# EAGLE design ADS1293+AFE4400testpcb (EAGLE 8.6.0)
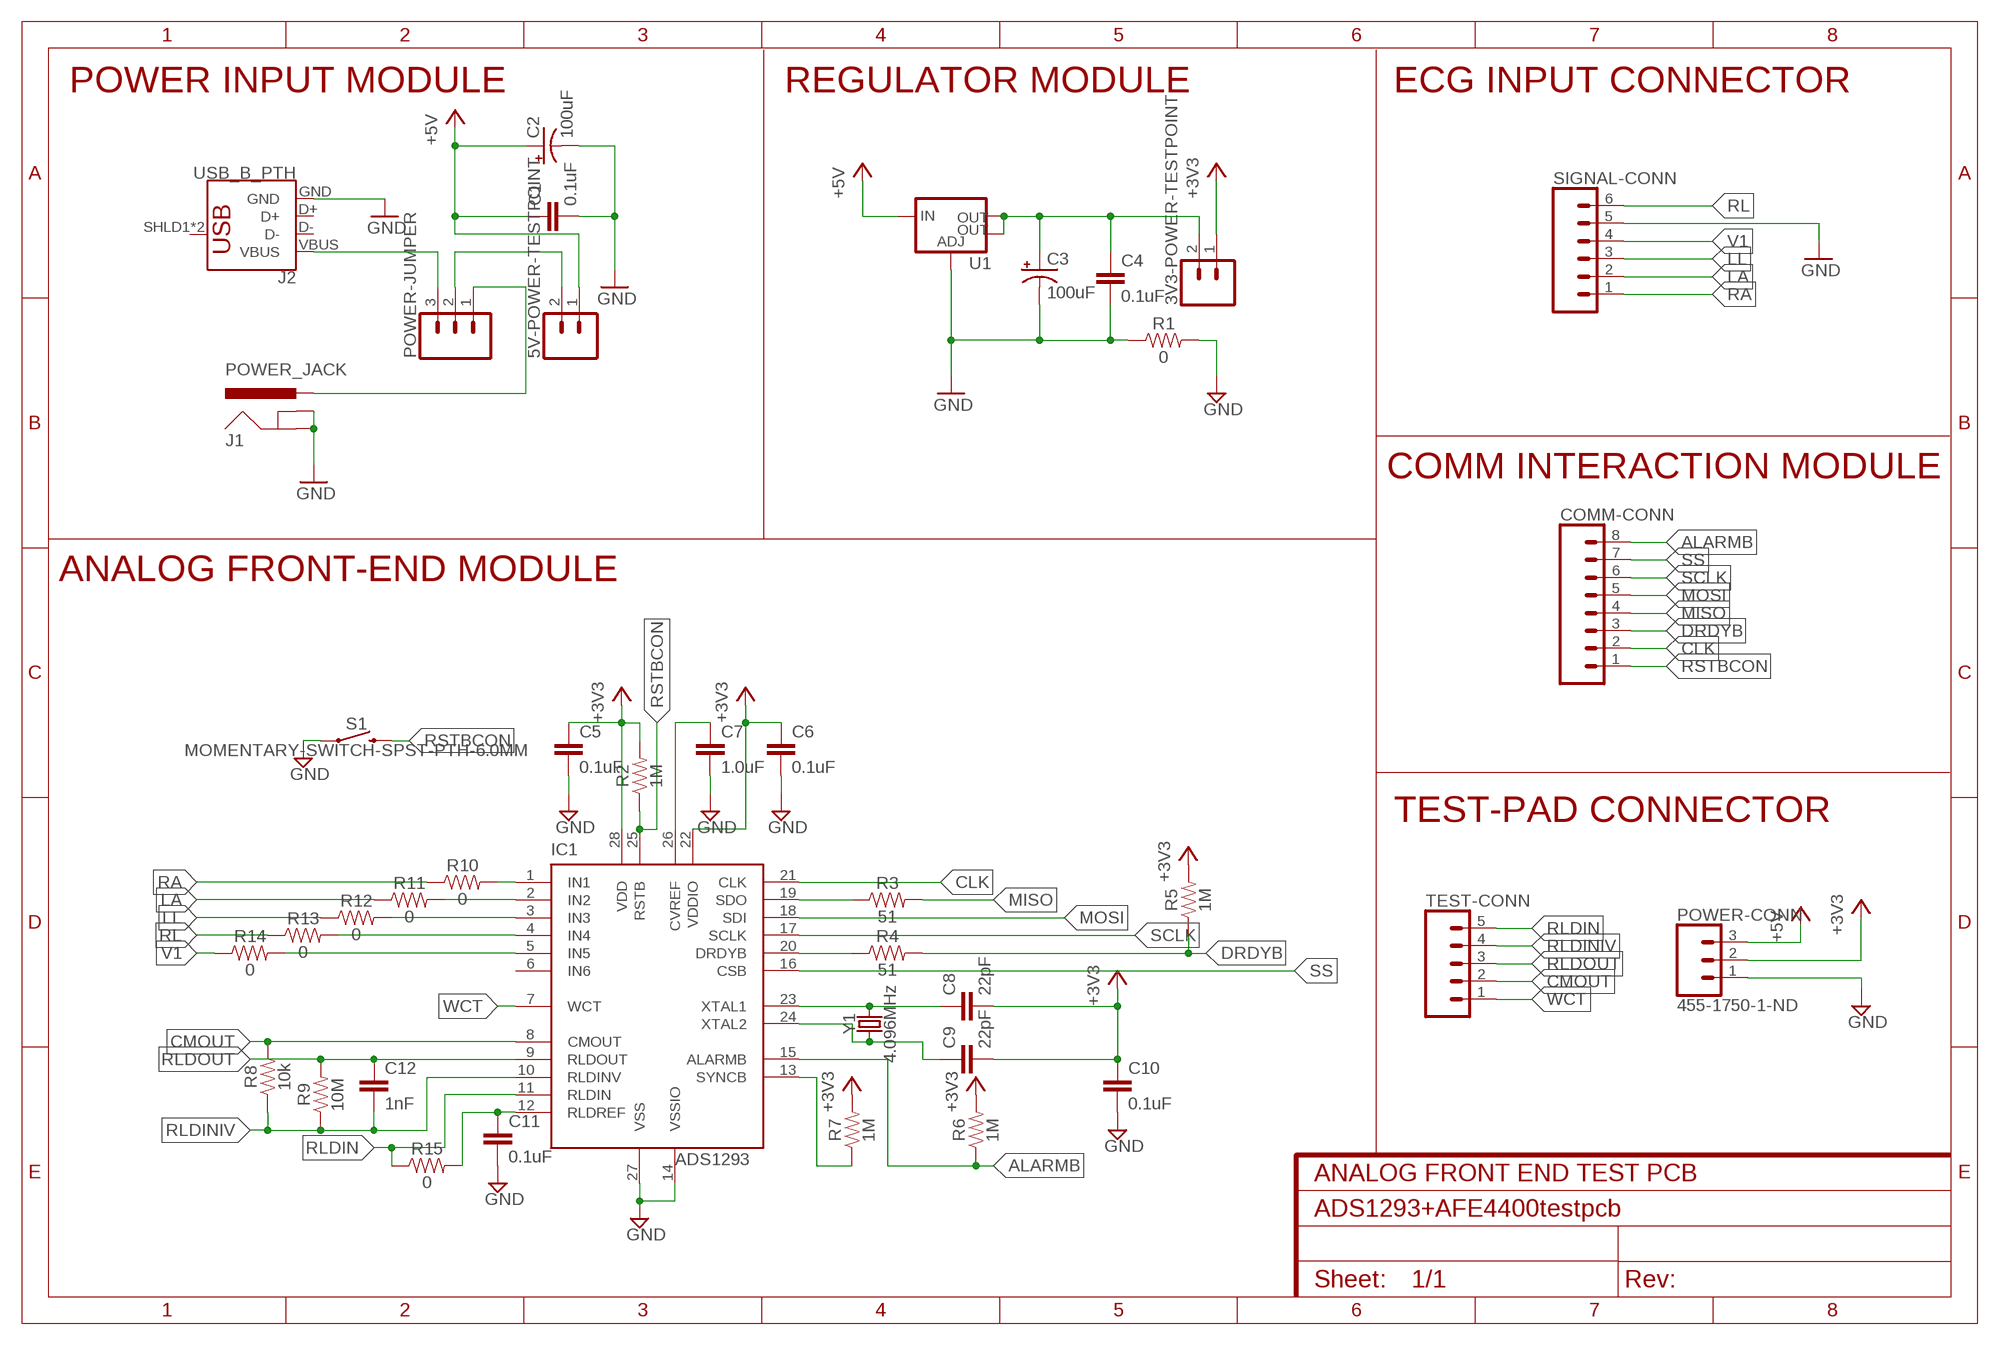
[diagram p0: schematic, sheet 1, part 1 of 2]
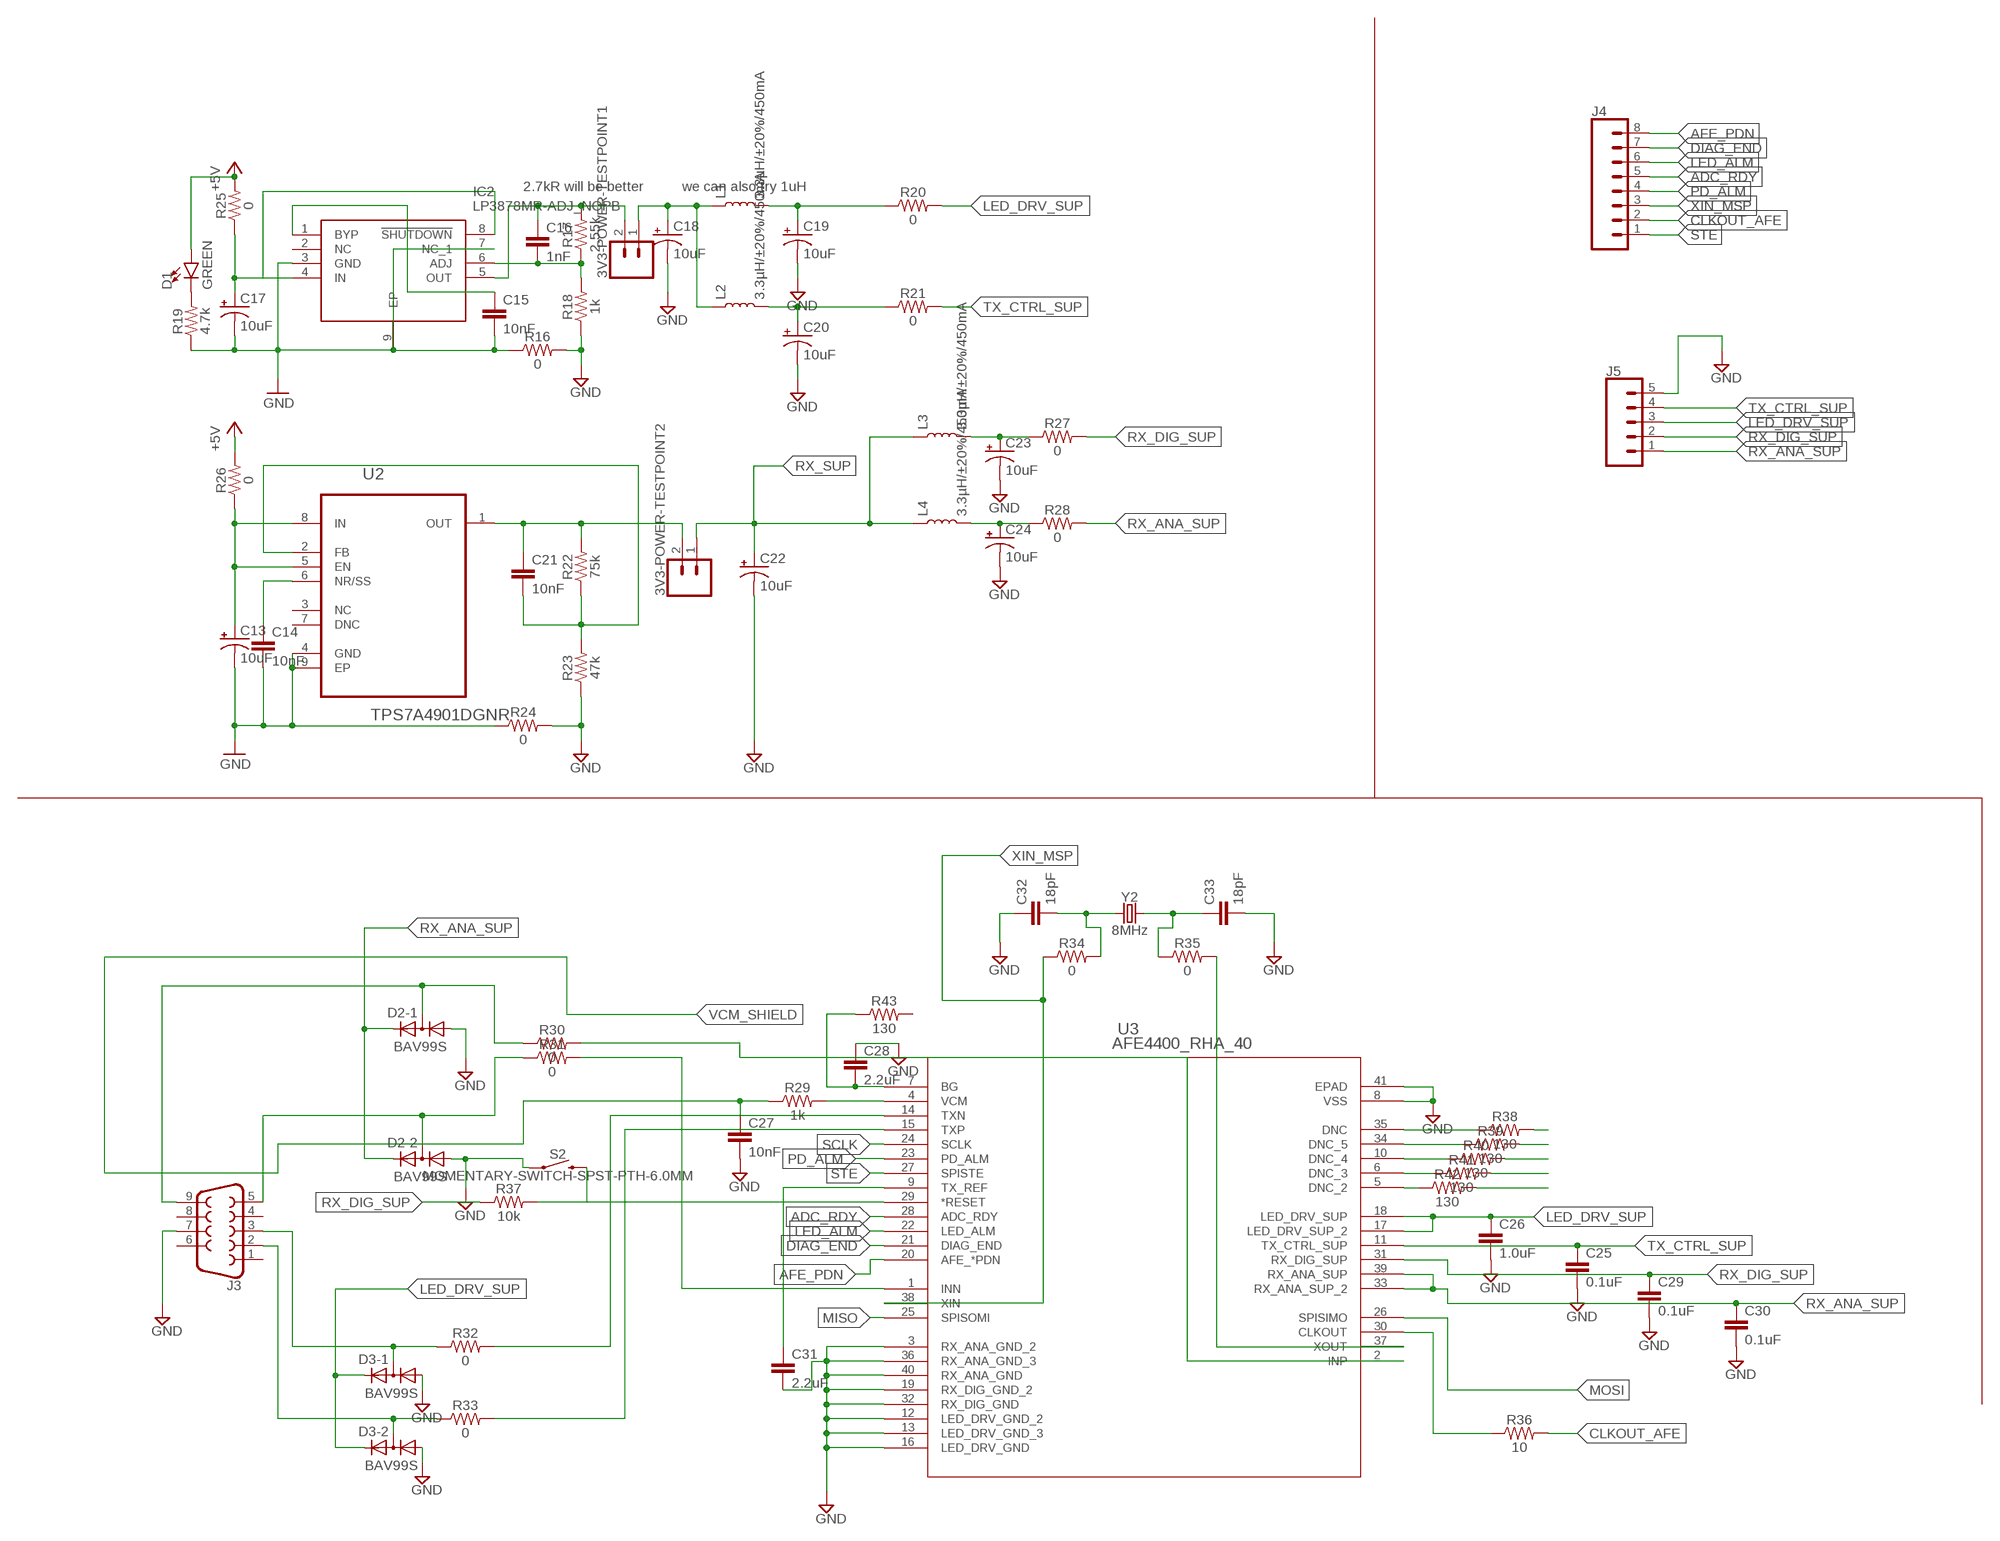
[diagram p1: schematic, sheet 1, part 2 of 2]
ADS1293TESTBOARD (FRAME-A4L): CNAME: ANALOG FRONT END TEST PCB; DESIGNER: JINGJIE LI

## Parts
3V3-POWER-TESTPOINT  CONN_02  [1X02]
3V3-POWER-TESTPOINT1  CONN_02  [1X02]
3V3-POWER-TESTPOINT2  CONN_02  [1X02]
5V-POWER-TESTPOINT  CONN_02  [1X02]
C1  0.1uF  0.1UF-0603-25V-(+80/-20%)  [0603]
C2  100uF  100UF-POLAR-RADIAL-2.5MM-25V-20%  [CPOL-RADIAL-2.5MM-6.5MM]
C3  100uF  100UF-POLAR-RADIAL-2.5MM-25V-20%  [CPOL-RADIAL-2.5MM-6.5MM]
C4  0.1uF  0.1UF-0603-25V-(+80/-20%)  [0603]
C5  0.1uF  0.1UF-0603-25V-(+80/-20%)  [0603]
C6  0.1uF  0.1UF-0603-25V-(+80/-20%)  [0603]
C7  1.0uF  1.0UF-0805-25V-10%  [0805]
C8  22pF  22PF-0603-50V-5%  [0603]
C9  22pF  22PF-0603-50V-5%  [0603]
C10  0.1uF  0.1UF-0603-25V-(+80/-20%)  [0603]
C11  0.1uF  0.1UF-0603-25V-(+80/-20%)  [0603]
C12  1nF  1.0NF/1000PF-0603-50V-10%  [0603]
C13  10uF  10UF-TANT  [EIA3216]
C14  10nF  10NF-0603-50V-10%  [0603]
C15  10nF  10NF-0603-50V-10%  [0603]
C16  1nF  1.0NF/1000PF-0603-50V-10%  [0603]
C17  10uF  10UF-TANT  [EIA3216]
C18  10uF  10UF-TANT  [EIA3216]
C19  10uF  10UF-TANT  [EIA3216]
C20  10uF  10UF-TANT  [EIA3216]
C21  10nF  10NF-0603-50V-10%  [0603]
C22  10uF  10UF-TANT  [EIA3216]
C23  10uF  10UF-TANT  [EIA3216]
C24  10uF  10UF-TANT  [EIA3216]
C25  0.1uF  0.1UF-0603-25V-5%  [0603]
C26  1.0uF  1.0UF-0805-25V-10%  [0805]
C27  10nF  10NF-0603-50V-10%  [0603]
C28  2.2uF  2.2UF-0805-25V-(+80/-20%)  [0805]
C29  0.1uF  0.1UF-0603-25V-5%  [0603]
C30  0.1uF  0.1UF-0603-25V-5%  [0603]
C31  2.2uF  2.2UF-0805-25V-(+80/-20%)  [0805]
C32  18pF  18PF-0603-50V-5%  [0603]
C33  18pF  18PF-0603-50V-5%  [0603]
COMM-CONN  CONN_08"  [1X08]
D1  GREEN  LED-GREEN1206  [LED-1206]
D2  BAV99S  [SOT363]
D3  BAV99S  [SOT363]
IC1  ADS1293  [QFN28-5X5]
IC2  LP3878MR-ADJ_NOPB  [SOIC127P602X168-9N]
J1  POWER_JACK  [POWER_JACK_PTH]
J2  USB_B_PTH  [USB-B-PTH]
J3  DB9FEMALE  [DB9]
J4  CONN_08"  [1X08]
J5  CONN_05  [1X05]
L1  3.3µH/±20%/450mA  INDUCTOR-0805-3.3UH  [0805]
L2  3.3µH/±20%/450mA  INDUCTOR-0805-3.3UH  [0805]
L3  3.3µH/±20%/450mA  INDUCTOR-0805-3.3UH  [0805]
L4  3.3µH/±20%/450mA  INDUCTOR-0805-3.3UH  [0805]
POWER-CONN  455-1750-1-ND  CONN_03  [1X03]
POWER-JUMPER  CONN_03  [1X03]
R1  0  0OHM-0603-1/10W-5%  [0603]
R2  1M  1MOHM-0603-1/4W-5%  [0603]
R3  51  22OHM-0603-1/10W-1%  [0603]
R4  51  22OHM-0603-1/10W-1%  [0603]
R5  1M  1MOHM-0603-1/4W-5%  [0603]
R6  1M  1MOHM-0603-1/4W-5%  [0603]
R7  1M  1MOHM-0603-1/4W-5%  [0603]
R8  10k  10KOHM-0603-1/10W-1%  [0603]
R9  10M  10MOHM-0603-1/10W-5%  [0603]
R10  0  0OHM-0603-1/10W-5%  [0603]
R11  0  0OHM-0603-1/10W-5%  [0603]
R12  0  0OHM-0603-1/10W-5%  [0603]
R13  0  0OHM-0603-1/10W-5%  [0603]
R14  0  0OHM-0603-1/10W-5%  [0603]
R15  0  0OHM-0603-1/10W-5%  [0603]
R16  0  0OHM-0603-1/10W-5%  [0603]
R17  2.55k  2.55KOHM-0603-1/10W-1%  [0603]
R18  1k  1KOHM-0603-1/10W-1%  [0603]
R19  4.7k  4.7KOHM-0603-1/10W-1%  [0603]
R20  0  0OHM-0603-1/10W-5%  [0603]
R21  0  0OHM-0603-1/10W-5%  [0603]
R22  75k  75KOHM-0603-1/10W-1%  [0603]
R23  47k  47KOHM-0603-1/10W-1%  [0603]
R24  0  0OHM-0603-1/10W-5%  [0603]
R25  0  0OHM-0603-1/10W-5%  [0603]
R26  0  0OHM-0603-1/10W-5%  [0603]
R27  0  0OHM-0603-1/10W-5%  [0603]
R28  0  0OHM-0603-1/10W-5%  [0603]
R29  1k  1KOHM-0603-1/10W-1%  [0603]
R30  0  0OHM-0603-1/10W-5%  [0603]
R31  0  0OHM-0603-1/10W-5%  [0603]
R32  0  0OHM-0603-1/10W-5%  [0603]
R33  0  0OHM-0603-1/10W-5%  [0603]
R34  0  0OHM-0603-1/10W-5%  [0603]
R35  0  0OHM-0603-1/10W-5%  [0603]
R36  10  10OHM-0603-1/10W-1%  [0603]
R37  10k  10KOHM-0603-1/10W-1%  [0603]
R38  130  330OHM-0603-1/10W-1%  [0603]
R39  130  330OHM-0603-1/10W-1%  [0603]
R40  130  330OHM-0603-1/10W-1%  [0603]
R41  130  330OHM-0603-1/10W-1%  [0603]
R42  130  330OHM-0603-1/10W-1%  [0603]
R43  130  330OHM-0603-1/10W-1%  [0603]
S1  MOMENTARY-SWITCH-SPST-PTH-6.0MM  [TACTILE_SWITCH_PTH_6.0MM]
S2  MOMENTARY-SWITCH-SPST-PTH-6.0MM  [TACTILE_SWITCH_PTH_6.0MM]
SIGNAL-CONN  CONN_06POLAR  [MOLEX-1X6]
TEST-CONN  CONN_05  [1X05]
U1  V_REG_LM1117SOT223  [SOT223]
U2  TPS7A4901DGNR  [SOP65P490X110-9N]
U3  AFE4400_RHA_40  [RHA40_4P15X4P15]
Y1  4.096MHz  CRYSTALPTH-HC49US  [HC49US]
Y2  8MHz  CRYSTAL-8MHZSMD-5X3.2  [CRYSTAL-SMD-5X3.2-4PAD]

## Nets
+3V3: 3V3-POWER-TESTPOINT.1 C5.1 C6.1 C8.2 C9.2 C10.1 IC1.22(VDDIO) IC1.28(VDD) POWER-CONN.2 R2.2 R5.2 R6.2 R7.2
+5V: 5V-POWER-TESTPOINT.1 C1.1 C2.1(+) D1.A POWER-CONN.3 R25.2 R26.2 U1.3(IN)
ADC_RDY: J4.5 U3.28(ADC_RDY)
AFE_PDN: J4.8 U3.20(AFE_*PDN)
ALARMB: COMM-CONN.8 IC1.15(ALARMB) R6.1
CLK: COMM-CONN.2 IC1.21(CLK)
CLKOUT_AFE: J4.2 R36.2
CMOUT: IC1.8(CMOUT) R8.2 TEST-CONN.2
DIAG_END: J4.7 U3.21(DIAG_END)
DRDYB: COMM-CONN.3 R4.2 R5.1
GND: C1.2 C2.2(-) C3.2(-) C4.2 C5.2 C6.2 C7.2 C10.2 C11.2 C13.C(-) C14.2 C15.2 C17.C(-) C18.C(-) C19.C(-) C20.C(-) C22.C(-) C23.C(-) C24.C(-) C25.2 C26.2 C27.2 C28.1 C29.2 C30.2 C31.2 C32.1 C33.2 D2.1(-1:A1) D2.4(-2:A1) D3.1(-1:A1) D3.4(-2:A1) IC1.14(VSSIO) IC1.27(VSS) IC2.3(GND) IC2.7(NC_1) IC2.9(EP) J1.GND J1.GNDBREAK J2.GND J3.7 J5.5 POWER-CONN.1 R1.1 R1.2 R16.1 R16.2 R18.1 R19.1 R23.1 R24.1 R24.2 S1.1 S2.1 SIGNAL-CONN.5 U1.1(ADJ) U2.4(GND) U2.9(EP) U3.3(RX_ANA_GND_2) U3.8(VSS) U3.12(LED_DRV_GND_2) U3.13(LED_DRV_GND_3) U3.16(LED_DRV_GND) U3.19(RX_DIG_GND_2) U3.32(RX_DIG_GND) U3.36(RX_ANA_GND_3) U3.40(RX_ANA_GND) U3.41(EPAD)
LA: R11.1 SIGNAL-CONN.2
LED_ALM: J4.6 U3.22(LED_ALM)
LED_DRV_SUP: C26.1 D3.2(-1:K2) D3.5(-2:K2) J5.3 R20.2 U3.17(LED_DRV_SUP_2) U3.18(LED_DRV_SUP)
LL: R12.1 SIGNAL-CONN.3
MISO: COMM-CONN.4 R3.2 U3.25(SPISOMI)
MOSI: COMM-CONN.5 IC1.18(SDI) U3.26(SPISIMO)
N$1: C7.1 IC1.26(CVREF)
N$2: J2.VBUS POWER-JUMPER.3
N$3: J1.PWR POWER-JUMPER.1
N$4: D1.C R19.2
N$5: C8.1 IC1.23(XTAL1) Y1.2
N$6: C9.1 IC1.24(XTAL2) Y1.1
N$7: IC1.19(SDO) R3.1
N$8: IC1.20(DRDYB) R4.1
N$9: IC1.13(SYNCB) R7.1
N$10: C11.1 IC1.12(RLDREF) R15.2
N$11: IC1.1(IN1) R10.2
N$12: IC1.2(IN2) R11.2
N$13: IC1.3(IN3) R12.2
N$14: IC1.4(IN4) R13.2
N$15: IC1.5(IN5) R14.2
N$16: 5V-POWER-TESTPOINT.2 POWER-JUMPER.2
N$17: 3V3-POWER-TESTPOINT.2 C3.1(+) C4.1 U1.2(OUT) U1.4(OUT)
N$18: 3V3-POWER-TESTPOINT1.1 C18.A(+) L1.1 L2.1
N$19: C16.2 IC2.6(ADJ) R17.1 R18.2
N$20: C15.1 IC2.1(BYP)
N$21: 3V3-POWER-TESTPOINT1.2 C16.1 IC2.5(OUT) R17.2
N$22: C14.1 U2.6(NR/SS)
N$23: C19.A(+) L1.2 R20.1
N$24: C20.A(+) L2.2 R21.1
N$25: C13.A(+) R26.1 U2.5(EN) U2.8(IN)
N$26: 3V3-POWER-TESTPOINT2.2 C21.1 R22.2 U2.1(OUT)
N$27: C21.2 R22.1 R23.2 U2.2(FB)
N$28: C23.A(+) L3.2 R27.1
N$29: C17.A(+) IC2.4(IN) IC2.8(!SHUTDOWN) R25.1
N$30: C24.A(+) L4.2 R28.1
N$31: C28.2 R43.1 U3.7(BG)
N$32: C31.1 U3.9(TX_REF)
N$33: R32.2 U3.14(TXN)
N$34: R29.2 U3.4(VCM)
N$36: R31.2 U3.1(INN)
N$37: R30.2 U3.2(INP)
N$38: D2.3(-2:K1A2) J3.5 R31.1
N$39: D2.6(-1:K1A2) J3.9 R30.1
N$40: R33.2 U3.15(TXP)
N$41: D3.6(-1:K1A2) J3.3 R32.1
N$42: D3.3(-2:K1A2) J3.2 R33.1
N$43: C32.2 R34.2 Y2.1
N$44: C33.1 R35.1 Y2.3
N$45: R36.1 U3.30(CLKOUT)
N$46: R37.2 S2.3 U3.29(*RESET)
N$48: R35.2 U3.37(XOUT)
N$49: R38.1 U3.35(DNC)
N$50: R42.1 U3.5(DNC_2)
N$52: R41.1 U3.6(DNC_3)
N$53: R40.1 U3.10(DNC_4)
N$54: R39.1 U3.34(DNC_5)
N$55: R38.2
N$56: R39.2
N$57: R40.2
N$58: R41.2
N$59: R42.2
PD_ALM: J4.4 U3.23(PD_ALM)
RA: R10.1 SIGNAL-CONN.1
RL: R13.1 SIGNAL-CONN.6
RLDIN: IC1.11(RLDIN) R15.1 TEST-CONN.5
RLDINIV: C12.2 IC1.10(RLDINV) R8.1 R9.1 TEST-CONN.4
RLDOUT: C12.1 IC1.9(RLDOUT) R9.2 TEST-CONN.3
RSTBCON: COMM-CONN.1 IC1.25(RSTB) R2.1 S1.3
RX_ANA_SUP: C30.1 D2.2(-1:K2) D2.5(-2:K2) J5.1 R28.2 U3.33(RX_ANA_SUP_2) U3.39(RX_ANA_SUP)
RX_DIG_SUP: C29.1 J5.2 R27.2 R37.1 U3.31(RX_DIG_SUP)
RX_SUP: 3V3-POWER-TESTPOINT2.1 C22.A(+) L3.1 L4.1
SCLK: COMM-CONN.6 IC1.17(SCLK) U3.24(SCLK)
SS: COMM-CONN.7 IC1.16(CSB)
STE: J4.1 U3.27(SPISTE)
TX_CTRL_SUP: C25.1 J5.4 R21.2 U3.11(TX_CTRL_SUP)
V1: R14.1 SIGNAL-CONN.4
VCM_SHIELD: C27.1 R29.1
WCT: IC1.7(WCT) TEST-CONN.1
XIN_MSP: J4.3 R34.1 U3.38(XIN)
Unconnected: IC1.6(IN6) IC2.2(NC) J2.D+ J2.D- J2.SHLD1(SHIELD) J2.SHLD2(SHIELD) J3.1 J3.4 J3.6 J3.8 R43.2 U2.3(NC) U2.7(DNC)

## Notes on the sheet
- 2.7kR will be better | we can also try 1uH
- POWER INPUT MODULE | REGULATOR MODULE | ECG INPUT CONNECTOR
- COMM INTERACTION MODULE
- ANALOG FRONT-END MODULE
- TEST-PAD CONNECTOR

## Library data of the parts
3V3-POWER-TESTPOINT 3V3-POWER-TESTPOINT1 3V3-POWER-TESTPOINT2 5V-POWER-TESTPOINT = SparkFun-Connectors:CONN_02: Multi connection point. Often used as Generic Header-pin footprint for 0.1 inch spaced/style header connections On any of the 0.1 inch spaced packages, you can populate with these: Break Away Headers - Straight <https://www.sparkfun.com/products/116> (PRT-00116) Break Away Male Headers - Right Angle <https://www.sparkfun.com/products/553> (PRT-00553) Female Headers <https://www.sparkfun.com/products/115> (PRT-00115) Break Away Headers - Machine Pin <https://www.sparkfun.com/products/117> (PRT-00117) Break Away Female Headers - Swiss Machine Pin <https://www.sparkfun.com/products/743> (PRT-00743) For SCREWTERMINALS and SPRING TERMINALS visit here: Screw Terimnals on SparkFun.com <https://www.sparkfun.com/search/results?term=Screw+Terminals> (5mm/3.5mm/2.54mm spacing) This device is also useful as a general connection point to wire up your design to another part of your project. Our various solder wires solder well into these plated through hole pads. Hook-Up Wire - Assortment (Stranded, 22 AWG) <https://www.sparkfun.com/products/11375> (PRT-11375) Hook-Up Wire - Assortment (Solid Core, 22 AWG) <https://www.sparkfun.com/products/11367> (PRT-11367) View the entire wire category on our website here <https://www.sparkfun.com/categories/141> Special notes: Molex polarized connector foot print use with: PRT-08233 with associated crimp pins and housings. 2.54_SCREWTERM for use with PRT-10571. 3.5mm Screw Terminal footprints for PRT-08084 5mm Screw Terminal footprints for use with PRT-08432
C1 C4-C6 C10 C11 = SparkFun-Capacitors:0.1UF: 0.1µF ceramic capacitors A capacitor is a passive two-terminal electrical component used to store electrical energy temporarily in an electric field.; PROD_ID: CAP-00810
C2 C3 = SparkFun-Capacitors:100UF-POLAR: 100µF polarized capacitors A capacitor is a passive two-terminal electrical component used to store electrical energy temporarily in an electric field.; PROD_ID: CAP-08439
C7 C26 = SparkFun-Capacitors:1.0UF: 1µF ceramic capacitors A capacitor is a passive two-terminal electrical component used to store electrical energy temporarily in an electric field.; PROD_ID: CAP-08064
C8 C9 = SparkFun-Capacitors:22PF: 22pF ceramic capacitors A capacitor is a passive two-terminal electrical component used to store electrical energy temporarily in an electric field.; PROD_ID: CAP-07876
C12 C16 = SparkFun-Capacitors:1.0NF/1000PF: 1nF/1,000pF ceramic capacitors A capacitor is a passive two-terminal electrical component used to store electrical energy temporarily in an electric field.; PROD_ID: CAP-07886
C13 C17-C20 C22-C24 = SparkFun-Retired:10UF-TANT: 10uF Tantalum SMT CAP-00811- 16V 10% (EIA-3216); PROD_ID: CAP-00811
C14 C15 C21 C27 = SparkFun-Capacitors:10NF: 0.01uF/10nF/10,000pF ceramic capacitors A capacitor is a passive two-terminal electrical component used to store electrical energy temporarily in an electric field. CAP-09321; PROD_ID: CAP-00867
C25 C29 C30 = SparkFun-Capacitors:0.1UF: 0.1µF ceramic capacitors A capacitor is a passive two-terminal electrical component used to store electrical energy temporarily in an electric field.; PROD_ID: CAP-08604
C28 C31 = SparkFun-Capacitors:2.2UF: 2.2µF ceramic capacitors A capacitor is a passive two-terminal electrical component used to store electrical energy temporarily in an electric field.; PROD_ID: CAP-11624
C32 C33 = SparkFun-Capacitors:18PF: 18pF ceramic capacitors A capacitor is a passive two-terminal electrical component used to store electrical energy temporarily in an electric field.; PROD_ID: CAP-08267
COMM-CONN J4 = SparkFun-Connectors:CONN_08: Multi connection point. Often used as Generic Header-pin footprint for 0.1 inch spaced/style header connections On any of the 0.1 inch spaced packages, you can populate with these: Break Away Headers - Straight <https://www.sparkfun.com/products/116> (PRT-00116) Break Away Male Headers - Right Angle <https://www.sparkfun.com/products/553> (PRT-00553) Female Headers <https://www.sparkfun.com/products/115> (PRT-00115) Break Away Headers - Machine Pin <https://www.sparkfun.com/products/117> (PRT-00117) Break Away Female Headers - Swiss Machine Pin <https://www.sparkfun.com/products/743> (PRT-00743) Arduino Stackable Header - 8 Pin <https://www.sparkfun.com/products/9279> (PRT-09279) For SCREWTERMINALS and SPRING TERMINALS visit here: Screw Terimnals on SparkFun.com <https://www.sparkfun.com/search/results?term=Screw+Terminals> (5mm/3.5mm/2.54mm spacing) This device is also useful as a general connection point to wire up your design to another part of your project. Our various solder wires solder well into these plated through hole pads. Hook-Up Wire - Assortment (Stranded, 22 AWG) <https://www.sparkfun.com/products/11375> (PRT-11375) Hook-Up Wire - Assortment (Solid Core, 22 AWG) <https://www.sparkfun.com/products/11367> (PRT-11367) View the entire wire category on our website here <https://www.sparkfun.com/categories/141> Special notes: Molex polarized connector foot print use with SKU : PRT-08231 with associated crimp pins and housings. 1MM SMD Version SKU: PRT-10208 NOTES ON THE VARIANTS LOCK and LOCK_LONGPADS... This footprint was designed to help hold the alignment of a through-hole component (i.e. 6-pin header) while soldering it into place. You may notice that each hole has been shifted either up or down by 0.005 of an inch from it's more standard position (which is a perfectly straight line). This slight alteration caused the pins (the squares in the middle) to touch the edges of the holes. Because they are alternating, it causes a "brace" to hold the component in place. 0.005 has proven to be the perfect amount of "off-center" position when using our standard breakaway headers. Although looks a little odd when you look at the bare footprint, once you have a header in there, the alteration is very hard to notice. Also,if you push a header all the way into place, it is covered up entirely on the bottom side.; PROD_ID: CONN-08438
D1 = SparkFun-LED:LED-GREEN: Green SMD LED Used in manufacturing of various products at SparkFun Packages: 0603 - SMD 0603 package [Product Link] <http://www.futureelectronics.com/en/technologies/semiconductors/optoelectronics/leds/Pages/9894312-LTST-C190GKT.aspx?CrossPart=HSMG-C190&IM=0> LilyPad 1206 - SMD1206 LilyPad package [Product Link] <http://www.futureelectronics.com/en/Technologies/Product.aspx?ProductID=IN150NGHARVATEKCORPORATION2049943&IM=0> 1206 - SMD1206 package [Product Link] <http://www.futureelectronics.com/en/technologies/semiconductors/optoelectronics/leds/Pages/8315665-LTST-C150KGKT.aspx?IM=0> 1206 Bottom Mount -SMD 1206 Bottom Mount [Product Link] <http://www.digikey.com/product-detail/en/lite-on-inc/LTST-C230KGKT/160-1456-1-ND/386854> SparkFun Products: Pro Mini 328 -5V <https://www.sparkfun.com/products/821> RedBoard <https://www.sparkfun.com/products/12757> MP3 Trigger <https://www.sparkfun.com/products/13720> Makey Makey <https://www.sparkfun.com/products/11076>; PROD_ID: DIO-00862
D2 D3 = nxp_60:BAV99S: High-speed switching diode High-speed switching diodes, encapsulated in small Surface-Mounted Device (SMD) plastic packages. AAL Eindhoven MK
IC1 = texas-ads1293:ADS1293: The ADS1293 incorporates all features commonly required in portable, low-power medical, sports, and fitness electrocardiogram (ECG) applications. With high levels of integration and exceptional performance, the ADS1293 enables the creation of scalable medical instrumentation systems at significantly reduced size, power, and overall cost. The library has been designed by Richard Magdycz <https://www.facebook.com/groups/eaglecadsoftUK>
IC2 = LP3878MR-ADJ_NOPB:LP3878MR-ADJ_NOPB: Micropower 800mA Low Noise 'Ceramic Stable' Adjustable Voltage Regulator for 1V to 5V App. Source: Datasheet <http://www.ti.com/lit/ds/symlink/lp3878-adj.pdf>; ARROW_PART_NUMBER: LP3878MR-ADJ/NOPB; ARROW_PRICE/STOCK: https://www.arrow.com/en/products/lp3878mr-adjnopb/texas-instruments; DESCRIPTION: Micropower 800mA Low Noise 'Ceramic Stable' Adjustable Voltage Regulator for 1V to 5V App.; HEIGHT: 1.68mm; MANUFACTURER_NAME: Texas Instruments; MANUFACTURER_PART_NUMBER: LP3878MR-ADJ/NOPB; RS_PART_NUMBER: 1218984; RS_PRICE/STOCK: http://uk.rs-online.com/web/p/products/1218984
J1 = SparkFun-Connectors:POWER_JACK: Power Jack Connector This is the standard 5.5mm barrel jack for power. The PTH is the most common, proven, reliable, footprint. The Slot footprint only works if the mill layer is transmitted to the PCB fab house so be warned. Here are the connectors we sell at SparkFun: DC Barrel Power Jack/Connector <https://www.sparkfun.com/products/119> (PRT-00119) DC Barrel Power Jack/Connector (SMD) <https://www.sparkfun.com/products/12748> (PRT-12748) DC Barrel Jack Adapter - Breadboard Compatible <https://www.sparkfun.com/products/10811> (PRT-10811) It is used on this SparkFun product (and many, many others): SparkFun RedBoard - Programmed with Arduino <https://www.sparkfun.com/products/12757> (DEV-12757) Also, if you need a mating power supply or connector, please check these out: Wall Adapter Power Supply - 9VDC 650mA <https://www.sparkfun.com/products/298> (TOL-00298) DC Barrel Jack Adapter - Male <https://www.sparkfun.com/products/10287> (PRT-10287); PROD_ID: CONN-08197
J2 = SparkFun-Connectors:USB_B: USB Type B Connector SparkFun Products: SparkFun Stepoko <https://www.sparkfun.com/products/13899> PTH; PROD_ID: CONN-08278; SF_ID: PRT-00139
J3 = SparkFun-Connectors:DB9: DB9 Connector Standard DB9 (D-Sub 9) serial connector. Can be used for CAN bus as well as RS485 and RS232. Footprint production proven. Here is the female version connector we sell at SparkFun: 9 Pin Female Serial Connector - PCB Mount <https://www.sparkfun.com/products/429> (PRT-00429) This connector has been used on the following SparkFun products: SparkFun RS232 Shifter - SMD <https://www.sparkfun.com/products/449> (PRT-00449) SparkFun RS232 Shifter SMD (No DB9) <https://www.sparkfun.com/products/8780> (PRT-08780); PROD_ID: CONN-08194
J5 TEST-CONN = SparkFun-Connectors:CONN_05: Multi connection point. Often used as Generic Header-pin footprint for 0.1 inch spaced/style header connections On any of the 0.1 inch spaced packages, you can populate with these: Break Away Headers - Straight <https://www.sparkfun.com/products/116> (PRT-00116) Break Away Male Headers - Right Angle <https://www.sparkfun.com/products/553> (PRT-00553) Female Headers <https://www.sparkfun.com/products/115> (PRT-00115) Break Away Headers - Machine Pin <https://www.sparkfun.com/products/117> (PRT-00117) Break Away Female Headers - Swiss Machine Pin <https://www.sparkfun.com/products/743> (PRT-00743) For SCREWTERMINALS and SPRING TERMINALS visit here: Screw Terimnals on SparkFun.com <https://www.sparkfun.com/search/results?term=Screw+Terminals> (5mm/3.5mm/2.54mm spacing) This device is also useful as a general connection point to wire up your design to another part of your project. Our various solder wires solder well into these plated through hole pads. Hook-Up Wire - Assortment (Stranded, 22 AWG) <https://www.sparkfun.com/products/11375> (PRT-11375) Hook-Up Wire - Assortment (Solid Core, 22 AWG) <https://www.sparkfun.com/products/11367> (PRT-11367) View the entire wire category on our website here <https://www.sparkfun.com/categories/141> Special notes: Molex polarized connector foot print use with SKU : PRT-08231 with associated crimp pins and housings. 1MM SMD Version SKU: PRT-10208
L1-L4 = SparkFun-Coils:INDUCTOR: Inductors Resist changes in electrical current. Basically a coil of wire. SparkFun Products: SparkFun Load Cell Amplifier - HX711 <https://www.sparkfun.com/products/13879> IOIO-OTG - V2.2 <https://www.sparkfun.com/products/13613>; PROD_ID: NDUC-13076
POWER-CONN = SparkFun-Connectors:CONN_03: Multi connection point. Often used as Generic Header-pin footprint for 0.1 inch spaced/style header connections On any of the 0.1 inch spaced packages, you can populate with these: Break Away Headers - Straight <https://www.sparkfun.com/products/116> (PRT-00116) Break Away Male Headers - Right Angle <https://www.sparkfun.com/products/553> (PRT-00553) Female Headers <https://www.sparkfun.com/products/115> (PRT-00115) Break Away Headers - Machine Pin <https://www.sparkfun.com/products/117> (PRT-00117) Break Away Female Headers - Swiss Machine Pin <https://www.sparkfun.com/products/743> (PRT-00743) Stackable Header - 3 Pin (Female, 0.1") <https://www.sparkfun.com/products/13875> (PRT-13875) For SCREWTERMINALS and SPRING TERMINALS visit here: Screw Terimnals on SparkFun.com <https://www.sparkfun.com/search/results?term=Screw+Terminals> (5mm/3.5mm/2.54mm spacing) This device is also useful as a general connection point to wire up your design to another part of your project. Our various solder wires solder well into these plated through hole pads. Hook-Up Wire - Assortment (Stranded, 22 AWG) <https://www.sparkfun.com/products/11375> (PRT-11375) Hook-Up Wire - Assortment (Solid Core, 22 AWG) <https://www.sparkfun.com/products/11367> (PRT-11367) View the entire wire category on our website here <https://www.sparkfun.com/categories/141> Special notes: Molex polarized connector foot print use with SKU : PRT-08232 with associated crimp pins and housings.; PROD_ID: XXX-00000
POWER-JUMPER = SparkFun-Connectors:CONN_03: Multi connection point. Often used as Generic Header-pin footprint for 0.1 inch spaced/style header connections On any of the 0.1 inch spaced packages, you can populate with these: Break Away Headers - Straight <https://www.sparkfun.com/products/116> (PRT-00116) Break Away Male Headers - Right Angle <https://www.sparkfun.com/products/553> (PRT-00553) Female Headers <https://www.sparkfun.com/products/115> (PRT-00115) Break Away Headers - Machine Pin <https://www.sparkfun.com/products/117> (PRT-00117) Break Away Female Headers - Swiss Machine Pin <https://www.sparkfun.com/products/743> (PRT-00743) Stackable Header - 3 Pin (Female, 0.1") <https://www.sparkfun.com/products/13875> (PRT-13875) For SCREWTERMINALS and SPRING TERMINALS visit here: Screw Terimnals on SparkFun.com <https://www.sparkfun.com/search/results?term=Screw+Terminals> (5mm/3.5mm/2.54mm spacing) This device is also useful as a general connection point to wire up your design to another part of your project. Our various solder wires solder well into these plated through hole pads. Hook-Up Wire - Assortment (Stranded, 22 AWG) <https://www.sparkfun.com/products/11375> (PRT-11375) Hook-Up Wire - Assortment (Solid Core, 22 AWG) <https://www.sparkfun.com/products/11367> (PRT-11367) View the entire wire category on our website here <https://www.sparkfun.com/categories/141> Special notes: Molex polarized connector foot print use with SKU : PRT-08232 with associated crimp pins and housings.; PROD_ID: XXX-00000; VALUE: 455-1750-1-ND
R1 R10-R16 R20 R21 R24-R28 R30-R35 = SparkFun-Resistors:0OHM: 0Ω resistor A resistor is a passive two-terminal electrical component that implements electrical resistance as a circuit element. Resistors act to reduce current flow, and, at the same time, act to lower voltage levels within circuits. - Wikipedia; PROD_ID: RES-08609
R2 R5-R7 = SparkFun-Resistors:1MOHM: 1MΩ resistor A resistor is a passive two-terminal electrical component that implements electrical resistance as a circuit element. Resistors act to reduce current flow, and, at the same time, act to lower voltage levels within circuits. - Wikipedia; PROD_ID: RES-07868
R3 R4 = SparkFun-Resistors:22OHM: 22Ω resistor A resistor is a passive two-terminal electrical component that implements electrical resistance as a circuit element. Resistors act to reduce current flow, and, at the same time, act to lower voltage levels within circuits. - Wikipedia; PROD_ID: RES-08698; VALUE: 22
R8 R37 = SparkFun-Resistors:10KOHM: 10kΩ resistor A resistor is a passive two-terminal electrical component that implements electrical resistance as a circuit element. Resistors act to reduce current flow, and, at the same time, act to lower voltage levels within circuits. - Wikipedia; PROD_ID: RES-00824
R9 = SparkFun-Resistors:10MOHM: RES-09327; PROD_ID: RES-08283
R17 = SparkFun-Resistors:2.55KOHM: 2.55kΩ resistor A resistor is a passive two-terminal electrical component that implements electrical resistance as a circuit element. Resistors act to reduce current flow, and, at the same time, act to lower voltage levels within circuits. - Wikipedia; PROD_ID: RES-11227
R18 R29 = SparkFun-Resistors:1KOHM: 1kΩ resistor A resistor is a passive two-terminal electrical component that implements electrical resistance as a circuit element. Resistors act to reduce current flow, and, at the same time, act to lower voltage levels within circuits. - Wikipedia; PROD_ID: RES-07856
R19 = SparkFun-Resistors:4.7KOHM: 4.7kΩ resistor A resistor is a passive two-terminal electrical component that implements electrical resistance as a circuit element. Resistors act to reduce current flow, and, at the same time, act to lower voltage levels within circuits. - Wikipedia; PROD_ID: RES-07857
R22 = SparkFun-Resistors:75KOHM: 75Ω resistor A resistor is a passive two-terminal electrical component that implements electrical resistance as a circuit element. Resistors act to reduce current flow, and, at the same time, act to lower voltage levels within circuits. - Wikipedia; PROD_ID: RES-09737; VALUE: 75
R23 = SparkFun-Resistors:47KOHM: 47kΩ resistor A resistor is a passive two-terminal electrical component that implements electrical resistance as a circuit element. Resistors act to reduce current flow, and, at the same time, act to lower voltage levels within circuits. - Wikipedia; PROD_ID: RES-07871
R36 = SparkFun-Resistors:10OHM: 10Ω resistor A resistor is a passive two-terminal electrical component that implements electrical resistance as a circuit element. Resistors act to reduce current flow, and, at the same time, act to lower voltage levels within circuits. - Wikipedia; PROD_ID: RES-12581
R38-R43 = SparkFun-Resistors:330OHM: 330Ω resistor A resistor is a passive two-terminal electrical component that implements electrical resistance as a circuit element. Resistors act to reduce current flow, and, at the same time, act to lower voltage levels within circuits. - Wikipedia; PROD_ID: RES-00818; VALUE: 330
S1 S2 = SparkFun-Switches:MOMENTARY-SWITCH-SPST: Momentary Switch (Pushbutton) - SPST Normally-open (NO) SPST momentary switches (buttons, pushbuttons). Variants PTH-12MM - 12mm square, through-hole Momentary Pushbutton Switch - 12mm Square <https://www.sparkfun.com/products/9190> (COM-09190) PTH-6.0MM, PTH-6.0MM-KIT - 6.0mm square, through-hole Mini Pushbutton Switch <https://www.sparkfun.com/products/97> (COM-00097) KIT package intended for soldering kit's - only one side of pads' copper is exposed. PTH-RIGHT-ANGLE-KIT - Right-angle, through-hole Right Angle Tactile Button <https://www.sparkfun.com/products/10791> - Used on SparkFun BigTime Watch Kit <https://www.sparkfun.com/products/11734> SMD-12MM - 12mm square, surface-mount Tactile Button - SMD (12mm) <https://www.sparkfun.com/products/12993> (COM-12993) Used on SparkFun PicoBoard <https://www.sparkfun.com/products/11888> SMD-4.5MM - 4.5mm Square Trackball Switch Used on SparkFun Blackberry Trackballer Breakout <https://www.sparkfun.com/products/13169> SMD-4.6MMX2.8MM - 4.60mm x 2.80mm, surface mount Used on SparkFun SAMD21 Mini Breakout <https://www.sparkfun.com/products/13664> SMD-5.2MM, SMD-5.2-REDUNDANT - 5.2mm square, surface-mount Mini Pushbutton Switch - SMD <https://www.sparkfun.com/products/8720> (COM-08720) Used on Arduino Pro Mini <https://www.sparkfun.com/products/11114> REDUNDANT package connects both switch circuits together SMD-6.0X3.5MM - 6.0 x 3.5mm, surface mount Momentary Reset Switch SMD <https://www.sparkfun.com/products/8229> (COM-08229) SMD-6.2MM-TALL - 6.2mm square, surface mount Tactile Button - SMD (6mm) <https://www.sparkfun.com/products/12992> Used on SparkFun Digital Sandbox <https://www.sparkfun.com/products/12651> SMD-RIGHT-ANGLE - Right-angle, surface mount Used on SparkFun Block for Intel® Edison - Arduino <https://www.sparkfun.com/products/13036>; PROD_ID: SWCH-08441; SF_SKU: COM-00097
SIGNAL-CONN = SparkFun-Connectors:CONN_06: Multi connection point. Often used as Generic Header-pin footprint for 0.1 inch spaced/style header connections On any of the 0.1 inch spaced packages, you can populate with these: Break Away Headers - Straight <https://www.sparkfun.com/products/116> (PRT-00116) Break Away Male Headers - Right Angle <https://www.sparkfun.com/products/553> (PRT-00553) Female Headers <https://www.sparkfun.com/products/115> (PRT-00115) Break Away Headers - Machine Pin <https://www.sparkfun.com/products/117> (PRT-00117) Break Away Female Headers - Swiss Machine Pin <https://www.sparkfun.com/products/743> (PRT-00743) Arduino Stackable Header - 6 Pin <https://www.sparkfun.com/products/9280> (PRT-09280) For SCREWTERMINALS and SPRING TERMINALS visit here: Screw Terimnals on SparkFun.com <https://www.sparkfun.com/search/results?term=Screw+Terminals> (5mm/3.5mm/2.54mm spacing) This device is also useful as a general connection point to wire up your design to another part of your project. Our various solder wires solder well into these plated through hole pads. Hook-Up Wire - Assortment (Stranded, 22 AWG) <https://www.sparkfun.com/products/11375> (PRT-11375) Hook-Up Wire - Assortment (Solid Core, 22 AWG) <https://www.sparkfun.com/products/11367> (PRT-11367) View the entire wire category on our website here <https://www.sparkfun.com/categories/141>
U1 = SparkFun-IC-Power:V_REG_LM1117: Voltage Regulator LM1117 Standard adjustable voltage regulator but in SMD form. Spark Fun Electronics SKU : COM-00595; PROD_ID: VREG-08170
U2 = Texas Instruments_By_element14_Batch_1:TPS7A4901DGNR: ?36V, ?200mA, Ultralow-Noise, Negative LINEAR REGULATOR; MPN: TPS7A4901DGNR; OC_FARNELL: -; OC_NEWARK: 01T0879; PACKAGE: MSOP-8; SUPPLIER: Texas Instruments
U3 = AFE4400:AFE4400_RHA_40; MANUFACTURER_PART_NUMBER: afe4400_rha_40; VENDOR: Texas Instruments
Y1 = SparkFun-Clocks:CRYSTAL: Crystals (Generic) These are passive quartz crystals, which can be used as a clock source for a microcontroller. Crystal's are two-terminal devices. They require external "load" capacitors to generate an oscillating signal.
Y2 = SparkFun-Clocks:CRYSTAL-8MHZ: 8MHz Crystal Datasheet Example <http://www.futureelectronics.com/en/technologies/electromechanical/timing-devices/crystals/Pages/6008189-ABM3B-8.000MHZ-B2-T.aspx?IM=0> Frequency: 8MHz Frequency Tolerance: ±20ppm Load Capacitance: 18pF SparkFun Products: Pro Micro -3.3V/8MHz <https://www.sparkfun.com/products/12587> WAV Trigger <https://www.sparkfun.com/products/13660>; PROD_ID: XTAL-09431

## Board
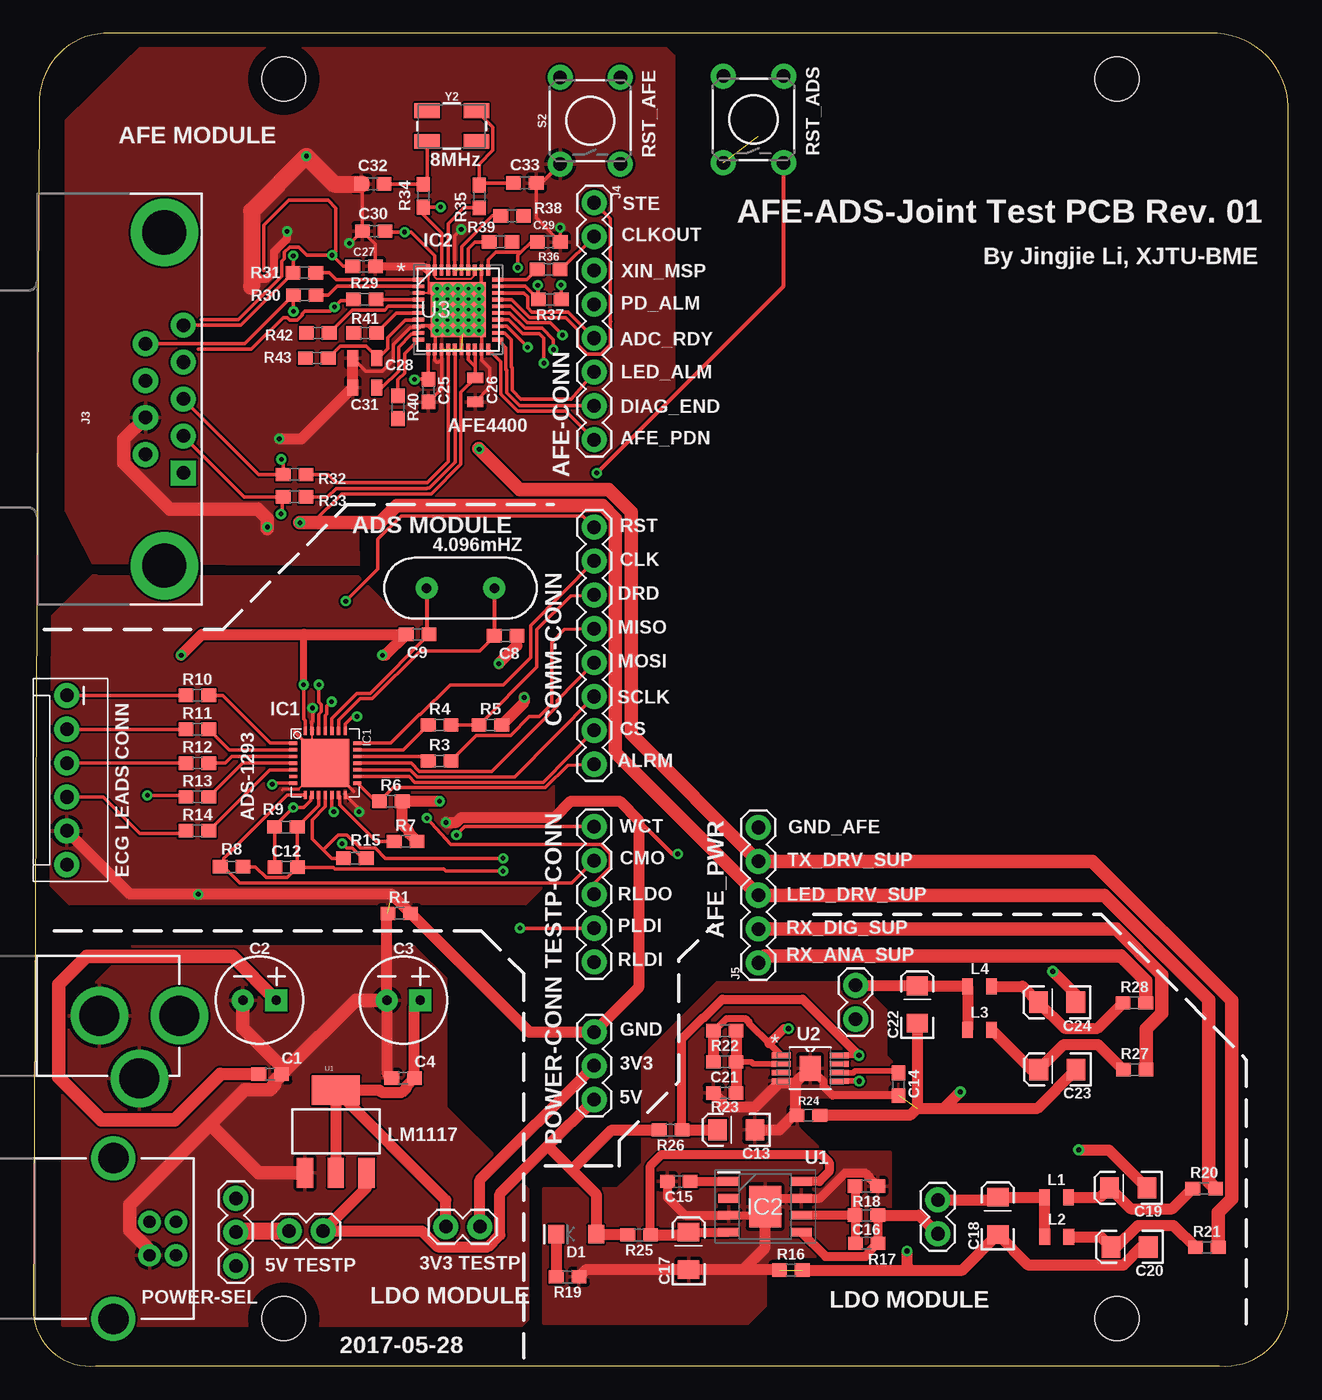
[diagram p2: board, top side]
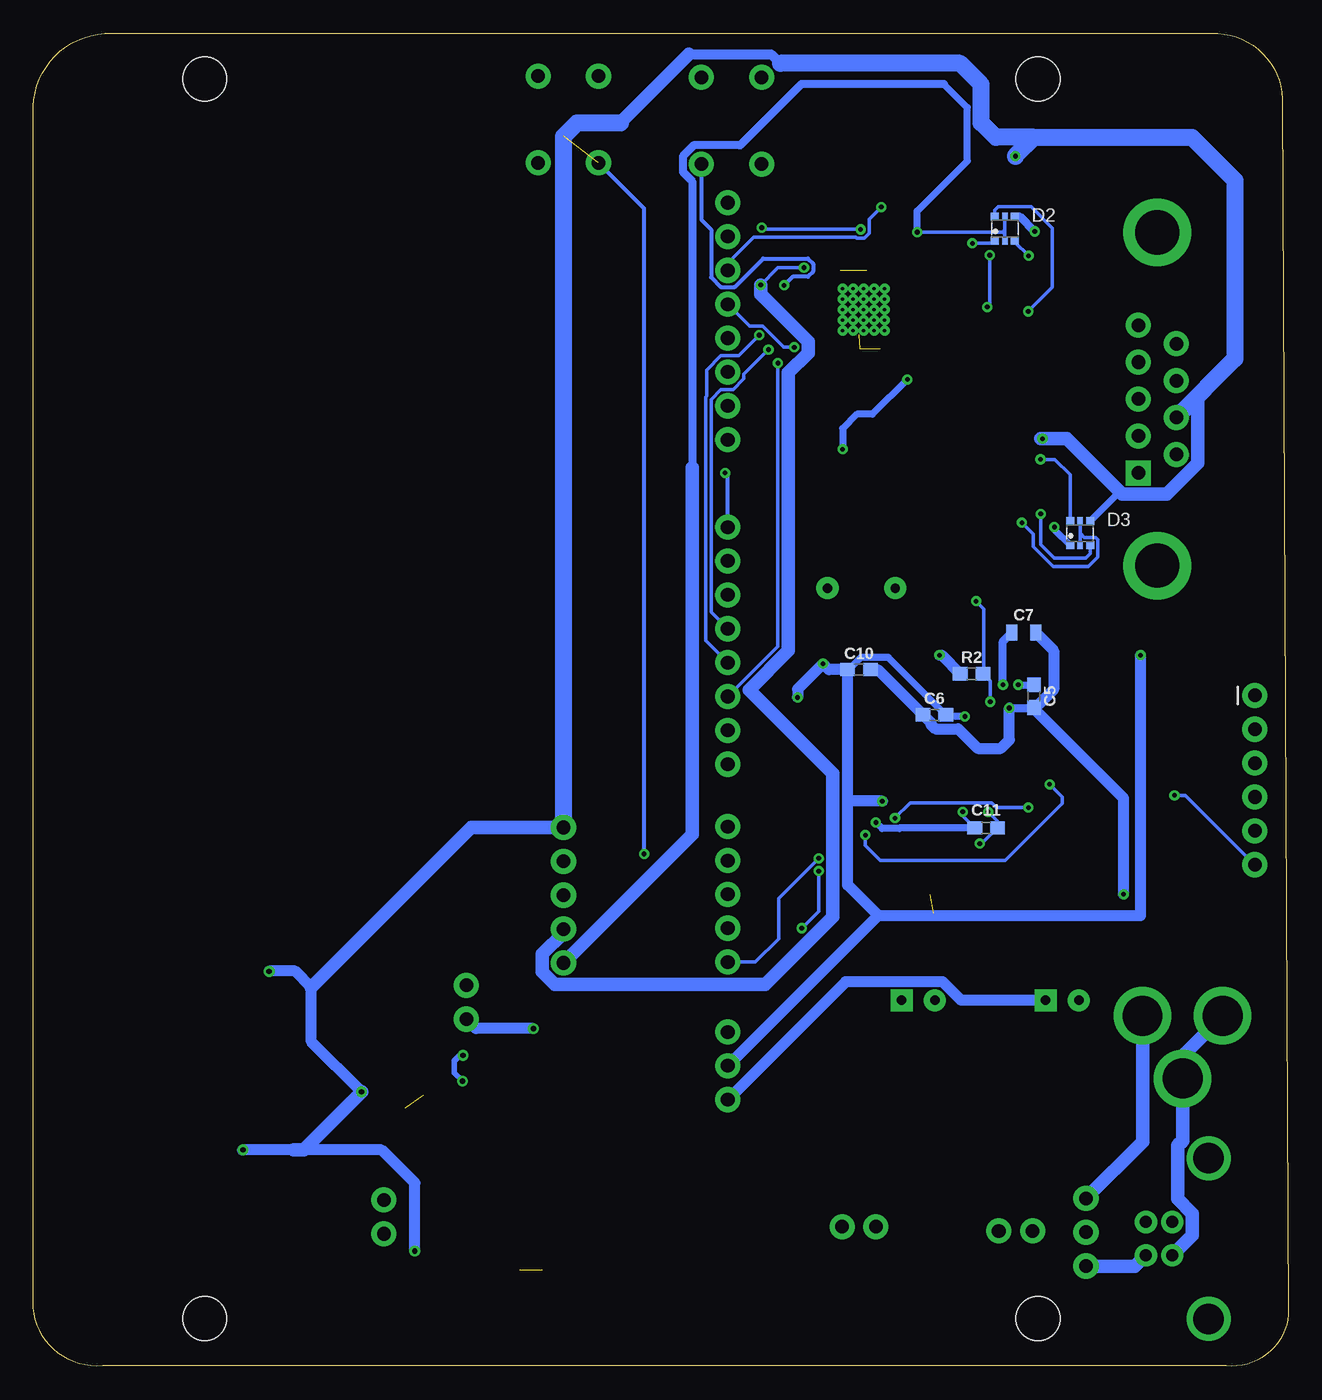
[diagram p3: board, bottom side, seen from below]

Size 94.11 x 99.97 mm. Coordinates in mm from the lower left corner, seen from the top.
Outline: 4.67,0.02 88.92,0.02 arc90 94.11,4.37 94.11,94.48 arc90 88.24,99.97 5.77,99.97 arc90 0.46,95.07 0,3.87 arc90 4.67,0.02
Copper layers (1*16): Top 0.035mm / dielectric 1.5mm / Bottom 0.035mm
Design rules "default": minimum track width 6mil, minimum drill 0.35mm, track to track 6mil, track to pad 6mil, pad to pad 6mil, via to via 6mil, smd to smd 6mil, copper to edge 40mil, drill to drill 6mil, minimum pad ring 10mil, minimum via ring 8mil, stop-mask expansion 4mil, vias tented up to drill 0mil, thermal gap 10mil

### Footprints (pad centres in the part's own frame; a part is rotated, then mirrored left to right if it is on the bottom)
1X02 = drill 1.016 pad 1.88: 1 0,0; 2 2.54,0
0603 = smd 1.1 x 1: 1 -0.85,0; 2 0.85,0
CPOL-RADIAL-2.5MM-6.5MM = drill 0.7 pad 1.651 square: 1 1.25,0 | drill 0.7 pad 1.651: 2 -1.25,0
0805 = smd 0.8 x 1.2: 1 -0.9,0; 2 0.9,0
EIA3216 = smd 1.4 x 1.6: A 1.4,0; C -1.4,0
1X08 = drill 1.016 pad 1.88: 1 0,0; 2 2.54,0; 3 5.08,0; 4 7.62,0; 5 10.16,0; 6 12.7,0; 7 15.24,0; 8 17.78,0
LED-1206 = smd 1.2 x 1.4: A -1.5,0; C 1.5,0
SOT363 = smd 0.6 x 0.6: 1 -0.75,-0.9; 3 0.75,-0.9; 4 0.75,0.9; 6 -0.75,0.9 | smd 0.4 x 0.6: 2 0,-0.9; 5 0,0.9
QFN28-5X5 = smd 0.25 x 0.6: 1 -1.5,-2.4; 2 -1,-2.4; 3 -0.5,-2.4; 4 0,-2.4; 5 0.5,-2.4; 6 1,-2.4; 7 1.5,-2.4; 15 1.5,2.4; 16 1,2.4; 17 0.5,2.4; 18 0,2.4; 19 -0.5,2.4; 20 -1,2.4; 21 -1.5,2.4 | smd 0.6 x 0.25: 8 2.4,-1.5; 9 2.4,-1; 10 2.4,-0.5; 11 2.4,0; 12 2.4,0.5; 13 2.4,1; 14 2.4,1.5; 22 -2.4,1.5; 23 -2.4,1; 24 -2.4,0.5; 25 -2.4,0; 26 -2.4,-0.5; 27 -2.4,-1; 28 -2.4,-1.5 | smd 3.6 x 3.6: GND 0,0
SOIC127P602X168-9N = smd 1.55 x 0.65: 1 -2.725,1.905; 2 -2.725,0.635; 3 -2.725,-0.635; 4 -2.725,-1.905; 5 2.725,-1.905; 6 2.725,-0.635; 7 2.725,0.635; 8 2.725,1.905 | smd 2.41 x 3.1: 9 0,0
POWER_JACK_PTH = drill 2.997 pad 4.318: GND 0,7.7; GNDBREAK 4.7,10.7; PWR 0,13.7
USB-B-PTH = drill 0.914 pad 1.676: D+ 4,1.25; D- 5.981,1.25; GND 4,-1.25; VBUS 5.981,-1.25 | drill 2.286: SHLD1 1.282,-6.02; SHLD2 1.282,6.02
DB9 = drill 1.016 pad 1.88 square: 1 -5.54,-1.42 | drill 1.016 pad 1.88: 2 -2.77,-1.42; 3 0,-1.42; 4 2.77,-1.42; 5 5.54,-1.42; 6 -4.15,1.42; 7 -1.38,1.42; 8 1.38,1.42; 9 4.15,1.42 | drill 3.302 pad 5.08: G1 -12.5,0; G2 12.5,0
1X05 = drill 1.016 pad 1.88: 1 0,0; 2 2.54,0; 3 5.08,0; 4 7.62,0; 5 10.16,0
1X03 = drill 1.016 pad 1.88: 1 0,0; 2 2.54,0; 3 5.08,0
TACTILE_SWITCH_PTH_6.0MM = drill 1.016 pad 1.88: 1 -3.251,2.261; 2 3.251,2.261; 3 -3.251,-2.261; 4 3.251,-2.261
MOLEX-1X6 = drill 1.016 pad 1.88: 1 0,0; 2 2.54,0; 3 5.08,0; 4 7.62,0; 5 10.16,0; 6 12.7,0
SOT223 = smd 1.219 x 2.235: 1 -2.311,-3.099; 2 0,-3.099; 3 2.311,-3.099 | smd 3.6 x 2.2: 4 0,3.099
SOP65P490X110-9N = smd 1.422 x 0.432: 1 -2.184,0.965; 2 -2.184,0.33; 3 -2.184,-0.33; 4 -2.184,-0.965; 5 2.184,-0.965; 6 2.184,-0.33; 7 2.184,0.33; 8 2.184,0.965 | smd 1.575 x 1.88: 9 0,0
RHA40_4P15X4P15 = smd 0.838 x 0.279: 1 -2.975,2.25; 2 -2.975,1.75; 3 -2.975,1.25; 4 -2.975,0.75; 5 -2.975,0.25; 6 -2.975,-0.25; 7 -2.975,-0.75; 8 -2.975,-1.25; 9 -2.975,-1.75; 10 -2.975,-2.25; 21 2.975,-2.25; 22 2.975,-1.75; 23 2.975,-1.25; 24 2.975,-0.75; 25 2.975,-0.25; 26 2.975,0.25; 27 2.975,0.75; 28 2.975,1.25; 29 2.975,1.75; 30 2.975,2.25 | smd 0.279 x 0.838: 11 -2.251,-2.975; 12 -1.75,-2.975; 13 -1.25,-2.975; 14 -0.75,-2.975; 15 -0.25,-2.975; 16 0.25,-2.975; 17 0.75,-2.975; 18 1.25,-2.975; 19 1.75,-2.975; 20 2.251,-2.975; 31 2.251,2.975; 32 1.75,2.975; 33 1.25,2.975; 34 0.75,2.975; 35 0.25,2.975; 36 -0.25,2.975; 37 -0.75,2.975; 38 -1.25,2.975; 39 -1.75,2.975; 40 -2.251,2.975 | smd 4.14 x 4.14: 41 0,0 | drill 0.254: V -1.575,-1.575; V_1 -1.575,-0.787; V_2 -1.575,0; V_3 -1.575,0.787; V_4 -1.575,1.575; V_5 -0.787,-1.575; V_6 -0.787,-0.787; V_7 -0.787,0; V_8 -0.787,0.787; V_9 -0.787,1.575; V_10 0,-1.575; V_11 0,-0.787; V_12 0,0; V_13 0,0.787; V_14 0,1.575; V_15 0.787,-1.575; V_16 0.787,-0.787; V_17 0.787,0; V_18 0.787,0.787; V_19 0.787,1.575; V_20 1.575,-1.575; V_21 1.575,-0.787; V_22 1.575,0; V_23 1.575,0.787; V_24 1.575,1.575
STAND-OFF = hole 3.302: 0,0
HC49US = drill 0.7 pad 1.651: 1 -2.54,0; 2 2.54,0
CRYSTAL-SMD-5X3.2-4PAD = smd 1.9 x 1.1: 1 -1.85,-1.15; 2 1.85,-1.15; 3 1.85,1.15; 4 -1.85,1.15

### Placement (x,y rotation side)
3V3-POWER-TESTPOINT  33.47,10.47 180 top
3V3-POWER-TESTPOINT1  67.82,12.47 270 top
3V3-POWER-TESTPOINT2  61.65,28.57 270 top
5V-POWER-TESTPOINT  21.73,10.15 180 top
C1  17.76,21.9 0 top
C2  16.96,27.45 0 top
C3  27.76,27.45 0 top
C4  27.73,21.61 180 top
C5  19.09,50.25 270 bottom
C6  26.55,48.85 180 bottom
C7  19.85,55.01 0 bottom
C8  35.41,54.79 0 top
C9  28.81,54.88 180 top
C10  32.2,52.25 0 bottom
C11  22.68,40.37 180 bottom
C12  18.96,37.42 0 top
C13  52.71,17.72 180 top
C14  64.87,21.15 270 top
C15  48.39,13.86 180 top
C16  62.46,11.32 180 top
C17  49.13,8.66 90 top
C18  72.32,11.27 90 top
C19  82.09,13.38 180 top
C20  82.2,8.94 180 top
C21  51.84,22.83 0 top
C22  66.27,27.12 90 top
C23  76.79,22.25 180 top
C24  76.76,27.3 180 top
C25  29.62,73.17 270 top
C26  33.12,73.22 270 top
C27  24.79,82.49 0 top
C28  24.84,75.61 0 top
C29  38.66,84.32 0 top
C30  25.53,85.14 180 top
C31  24.84,73.4 180 top
C32  25.45,88.67 0 top
C33  36.86,88.74 0 top
COMM-CONN  42.05,62.93 270 top
D1  40.69,9.9 180 top
D2  21.26,85.31 0 bottom
D3  15.62,62.48 0 bottom
IC1  21.88,45.23 270 top
IC2  54.87,11.96 0 top
J1  -2.75,26.28 270 top
J2  4.71,9.57 0 top
J3  9.83,72.54 90 top
J4  42.05,87.27 270 top
J5  54.36,30.25 90 top
L1  76.71,12.67 0 top
L2  76.74,9.7 0 top
L3  70.94,25.22 0 top
L4  70.94,28.49 0 top
POWER-CONN  42.05,25.07 270 top
POWER-JUMPER  15.18,12.59 270 top
R1  27.44,33.96 0 top
R2  23.76,51.93 180 bottom
R3  30.46,45.39 0 top
R4  30.46,48.09 0 top
R5  34.27,48.09 0 top
R6  26.81,42.37 0 top
R7  27.92,39.36 0 top
R8  14.87,37.45 180 top
R9  18.93,40.44 180 top
R10  12.3,50.31 0 top
R11  12.3,47.77 0 top
R12  12.3,45.23 0 top
R13  12.3,42.69 0 top
R14  12.3,40.15 0 top
R15  24.11,38.09 0 top
R16  56.8,7.21 0 top
R17  62.49,9.22 0 top
R18  62.46,13.51 180 top
R19  40.06,6.7 180 top
R20  87.78,13.33 0 top
R21  87.99,8.91 0 top
R22  51.84,25.17 180 top
R23  51.84,20.49 0 top
R24  58.12,18.82 0 top
R25  45.42,9.85 180 top
R26  47.78,17.72 180 top
R27  82.58,22.25 0 top
R28  82.55,27.25 0 top
R29  24.84,80 0 top
R30  20.35,80.34 0 top
R31  20.32,82.01 0 top
R32  19.59,66.87 0 top
R33  19.59,65.2 0 top
R34  29.24,87.78 90 top
R35  33.43,87.73 270 top
R36  38.64,82.27 0 top
R37  38.74,80 180 top
R38  35.89,86.28 0 top
R39  35.03,84.32 0 top
R40  27.33,71.93 270 top
R41  24.87,77.49 180 top
R42  21.34,77.49 180 top
R43  21.26,75.61 180 top
S1  54,93.51 90 top
S2  41.76,93.42 90 top
SIGNAL-CONN  2.52,50.31 270 top
TEST-CONN  42.05,40.47 270 top
U1  22.68,17.61 0 top
U2  58.24,22.35 0 top
U3  31.85,79.24 0 top
U$1  [STAND-OFF]  81.26,3.58 0 top
U$2  [STAND-OFF]  81.26,96.54 0 top
U$3  [STAND-OFF]  18.77,96.54 0 top
U$4  [STAND-OFF]  18.77,3.58 0 top
Y1  32.02,58.35 0 top
Y2  31.37,93.01 0 top

### Tracks (layer width: path | path; a pad name or v marks a point on that pad's centre or on a via)
+3V3  (via drill 0.35, 0.35 pad 0.55)
  Top 0.254: IC1.28 20.38,48.42 20.26,48.53 v20.26,51.11 | IC1.22 23.38,48.16 23.95,48.73 v24.27,48.73
  Top 0.508: v20.26,51.11 20.26,54.85 20.3,54.88
  Top 0.813: 3V3-POWER-TESTPOINT.1 33.47,13.96 POWER-CONN.2 | v34.9,52.69 36.26,54.05 C8.2 | v36.81,50.15 36.81,49.78 R5.2 | v11.09,53.33 12.64,54.88 20.3,54.88 C9.2 26.4,53.33 v26.17,53.33 | R7.2 28.18,39.95 28.18,40.09 27.66,40.61 R6.2 v30.46,42.38
  Bottom 0.508: v20.26,51.11 v20.26,51.1 C5.1 | v24.27,48.73 25.57,48.73 C6.1 30,53.16 32.07,53.16 32.98,52.25 C10.1
  Bottom 0.813: 24.54,52 R2.2 26,53.33 v26.17,53.33 | POWER-CONN.2 30.77,33.8 | 30.77,33.8 11.09,33.8 v11.09,53.33 | 30.77,33.8 33.05,36.08 33.05,42.38 | 33.05,42.38 C10.1 34.46,52.25 v34.9,52.69 36.81,50.79 v36.81,50.15 | v30.46,42.38 33.05,42.38
+5V
  Top 0.813: U1.3 24.99,13.41 5V-POWER-TESTPOINT.1 29.13,10.15 30.31,8.97 34.09,8.97 34.97,9.85 34.97,12.92 38.57,16.52 | 38.57,16.52 POWER-CONN.3 | 38.57,16.52 40.38,14.71 | 40.38,14.71 42.19,12.9 D1.A 42.24,9.85 R25.2 | 40.38,14.71 43.39,17.72 R26.2
  Top 0.889: C1.1 14,21.9
  Top 1.016: 14,21.9 10.59,18.49 5.08,18.49 1.91,21.66 1.91,28.62 4.02,30.73 14.94,30.73 C2.1
  Bottom 0.813: C2.1 24.55,27.45 25.93,28.84 33.2,28.84 POWER-CONN.3
ADC_RDY
  Top 0.254: U3.28 36.78,80.49 37.06,80.21 37.06,79.39 37.38,79.07 40.09,79.07 J4.5
AFE_PDN
  Top 0.254: U3.20 35.03,75.34 35.03,72.9 36.31,71.62 39.91,71.62 J4.8
ALARMB
  Top 0.254: IC1.15 25.64,42.38 R6.1 26.97,43.39 38.4,43.39 40.08,45.07 COMM-CONN.8
CLK
  Top 0.254: IC1.21 26.8,46.73 28.94,48.87 29.01,48.87 31.25,51.11 35.22,51.11 37.28,53.17 37.28,55.55 COMM-CONN.2
CLKOUT_AFE
  Top 0.254: J4.2 39.58,82.27 R36.2
CMOUT
  Top 0.254: TEST-CONN.2 40.35,36.24 15.49,36.24 14.27,37.45 R8.2 14.27,37.71 14.27,38.07 19.03,42.83 IC1.8
DIAG_END
  Top 0.254: U3.21 35.43,76.39 35.43,74.76 35.48,74.71 35.48,73.02 36.48,72.03 J4.7
DRDYB
  Top 0.254: R4.2 R5.1 37.76,52.43 37.76,55.23 40.3,57.77 COMM-CONN.3
GND  (via drill 0.35, 0.35 pad 0.55, 0.4)  (7 unrouted)
  Top 0.152: U3.40 29.6,80.52 29.57,80.49 U3.3 | U3.8 29.52,77.99 30.1,77.41 U3.12
  Top 0.203: 18.67,43.23 18.72,43.28 19.89,43.28 20.35,43.73 20.35,46.81
  Top 0.254: IC1.27 20.88,48.36 20.93,48.41 v20.93,49.36 | IC1.14 24.42,41.79 v24.42,41.58 | 19.59,47.62 19.59,47.57 20.35,46.81 | 24,43.12 23.5,43.63 23.47,43.63 | C30.2 25.64,84.17 C27.2 | C32.1 24.68,88.59 C30.2 | U3.8 28.8,77.91 28.27,77.91 26.98,76.62 26.98,75.45 26.17,74.65 24.91,74.65 C28.1 | U3.12 30.1,75.46 30.25,75.31 30.41,75.31 30.6,75.5 | 30.6,75.5 U3.13 | 30.6,75.5 30.6,73.31 C25.2 | U3.41 31.85,77.72 32.18,77.39 | U3.36 31.6,84.78 v32.08,85.26 | C33.2 37.71,86.13 C29.2 39.51,85.38 v39.5,85.39 | U3.19 33.6,75.46 34.22,74.85 34.22,73.42 C26.2 | C30.2 23.76,84.22 v23.7,84.22
  Top 0.305: S2.1 38.08,88.74 C33.2 | 45.38,40.95 47.9,38.43 v48.31,38.43
  Top 0.406: U2.4 55.92,21.24
  Top 0.61: IC2.3 54.84,11.32 54.87,11.3 | U2.9 59.26,21.33 59.26,20.98 59.93,20.3 C14.2 | 16.36,80.97 16.97,81.58 17.52,81.58 18.06,82.12 18.06,83.61 19.03,84.58 v19.03,85.11 19.03,85.14 | C27.2 29.23,82.49 29.51,82.22
  Top 0.66: C15.2 47.54,12.66 48.87,11.32 IC2.3 | IC2.9 55.5,12.59 IC2.7 58.96,12.59 60.86,14.49 62.36,14.49 62.64,14.21 62.64,14.18 R18.1
  Top 0.813: C4.2 26.51,21.98 C3.2 26.51,33.88 R1.1 | SIGNAL-CONN.5 7.28,35.39 v12.36,35.39 26.86,35.39 R1.2 37.18,25.07 POWER-CONN.1 45.38,28.41 45.38,40.95 43.95,42.38 40.3,42.38 39.08,41.16 32.08,41.16 31.71,40.79 v30.93,40.79 | R19.1 41.46,7.26 C17.C 53.24,7.26 | IC2.9 54.87,11.3 54.87,8.89 53.24,7.26 | 53.24,7.26 55.9,7.26 R16.1 | R16.2 65.81,7.21 | 65.81,7.21 69.65,7.21 C18.C 74.61,7.58 81.73,7.58 83.09,8.94 C20.C | 65.81,7.21 65.51,7.51 v65.51,8.63 | 83.6,13.28 C19.C 80.65,16.23 v78.39,16.23 | R23.1 51.58,19.9 51.58,19.76 51.91,19.43 54.11,19.43 55.92,21.24 57.14,21.24 | 57.14,21.24 U2.9 | 57.14,21.24 57.14,18.94 | 57.14,18.94 R24.1 | C13.C 55.92,17.72 57.14,18.94 | C22.C 66.27,19.35 | R24.2 65.74,18.82 66.27,19.35 | 66.27,19.35 68.28,19.35 | 68.28,19.35 75.29,19.35 C23.C | 68.28,19.35 v69.5,20.57 69.52,20.59 | v76.43,29.61 78.16,27.88 C24.C | v18.44,69.57 20.11,69.57 C31.2 C28.1
  Top 1.016: U1.1 16.89,14.51 13.25,18.15 | 13.25,18.15 15.84,20.74 17.73,20.74 18.12,21.12 18.12,21.41 C1.2 18.9,22.19 | 18.9,22.19 24.16,27.45 C3.2 | 18.9,22.19 15.71,25.37 C2.2 | J3.7 6.78,69.53 6.78,67.74 10.24,64.28 16.82,64.28 17.53,63.57 17.53,63.5 17.55,63.47 v17.55,62.94 17.55,62.83 | J2.GND 8.71,8.7 7.22,10.2 7.22,12.12 13.25,18.15
  Top 1.27: C32.1 22.56,88.67 v20.47,90.75 16.36,86.63 16.36,80.97
  Bottom 0.254: v24.42,41.58 24.42,41.27 C11.2 | v39.5,85.39 39.37,85.26 v32.08,85.26 | v23.7,84.22 22.2,84.22 D2.1
  Bottom 0.305: v48.31,38.43 48.31,86.83 S1.1
  Bottom 0.508: 20.93,49.52 v20.93,49.36 | C11.2 29.12,40.37 29.18,40.32 30.47,40.32 v30.93,40.79 | 12.47,65.4 12.85,65.4 D3.4 | v17.55,62.94 17.55,62.76 D3.1
  Bottom 0.61: v20.93,49.36 19.13,49.36 C5.2 | v19.03,85.11 20.13,86.21 D2.4
  Bottom 0.762: 38.1,97.71 38.78,98.39 44.96,98.39
  Bottom 0.813: v12.36,35.39 12.36,42.59 19.13,49.36 18.99,49.36 17.6,50.74 17.6,53.66 C7.2 | C10.2 30.8,52.25 C6.2 26.81,48.26 26.81,48.12 26.48,47.79 24.76,47.79 23.31,46.34 21.57,46.34 20.93,46.98 v20.93,49.36 | v65.51,8.63 65.51,13.74 68,16.23 74.58,16.23 v78.39,16.23 78.41,16.23 | v69.5,20.57 73.26,24.33 73.26,28.42 74.47,29.64 76.41,29.64 v76.43,29.61
  Bottom 1.016: 73.26,28.42 61.27,40.41 J5.5 | v69.5,20.57 73.84,16.23 74.58,16.23 | 50.09,93.26 44.96,98.39 | 4.02,75.55 6.81,72.76 6.81,67.72 9.14,65.4 12.47,65.4 16.63,69.57 v18.44,69.57 18.57,69.57 | J1.GND 7.95,23.28 J1.GNDBREAK 7.95,16.91 8.31,16.55 8.31,12.53 7.22,11.44 7.22,9.82 J2.GND
  Bottom 1.27: J5.5 54.36,92.25 53.34,93.26 50.09,93.26 | 38.1,97.71 24.61,97.71 23.04,96.13 23.04,93.26 21.95,92.17 19.08,92.17 | 19.08,92.17 7.24,92.17 4.02,88.95 4.02,75.55 J3.7 | 19.08,92.17 20.47,90.77 v20.47,90.75
  pour Top: 8.38,99.31 47.04,99.31 48.06,98.29 48.06,67.81 46.05,65.81 39.65,65.81 38.2,64.36 24.31,64.36 24.39,60.07 4.45,60.22 2.44,64.13 2.44,93.47
  pour Top: 4.68,59.2 24.36,59.2 24.92,58.64 27.56,56 38.97,56 38.97,36.77 36.91,34.72 2.69,34.72 1.58,35.83 1.02,36.39 1.02,55.82 4.47,59.28 4.75,59.28
  pour Top: 38.28,3.27 38.28,13.3 43.79,13.3 44.55,14.07 45.7,15.21 45.7,19.76 45.7,23.19 51.26,28.75 61.9,28.75 63.91,26.74 63.91,23.26 64.82,22.35 64.82,20.21 57.46,20.21 57.33,20.34 57.33,17.9 59.21,16.02 64.24,16.02 64.24,8.33 64.31,8.25 55.86,8.25 54.87,7.67 54.87,4.52 53.57,3.22 38.28,3.22
  pour Top: 2.21,26.28 7.37,31.44 9.6,31.44 28.55,31.44 28.65,31.34 30.91,29.08 30.91,23.92 30.91,19.43 37.06,13.28 37.06,3.5 36.63,3.07 2.21,3.07
LA
  Top 0.254: SIGNAL-CONN.2 R11.1
LED_ALM
  Top 0.254: U3.22 35.33,77.49 35.84,76.98 35.84,74.93 35.89,74.88 35.89,73.19 36.54,72.55 40.32,72.55 J4.6
LED_DRV_SUP  (via drill 0.35)
  Top 0.254: U3.18 33.12,76.25 33.12,74.98 | 33.12,74.98 C26.1 32.06,73.06 32.06,67.65 29.83,65.43 23.12,65.43 20.96,63.27 v19.99,63.27 | U3.17 32.6,75.5 33.12,74.98
  Top 1.016: R20.2 88.14,13.82 88.14,27.48 80.29,35.33 J5.3 43.65,46.04 43.65,63.59 42.68,64.56 27.26,64.56 25.96,63.27 v19.99,63.27
  Bottom 0.254: D3.2 15.62,62.48 | 15.62,62.48 D3.5 | v19.99,63.27 19.15,62.43 19.15,61.46 17.65,59.96 15.01,59.96 14.29,60.68 14.29,61.99 14.46,62.16 15.3,62.16 15.62,62.48
LL
  Top 0.254: SIGNAL-CONN.3 R12.1
MISO  (via drill 0.35)
  Top 0.254: R3.2 33.23,47.31 35.78,47.31 37.2,48.73 37.92,48.73 38.87,49.68 38.87,54.28 39.82,55.23 COMM-CONN.4 | U3.25 35.73,78.99 36.88,77.85 38.15,77.85 38.99,77.01 v38.99,76.25 38.99,76.22
  Bottom 0.254: v38.99,76.25 40.83,74.41 40.83,74.06 41.64,73.25 42.55,73.25 43.28,72.52 43.28,56.55 COMM-CONN.4
MOSI  (via drill 0.35)
  Top 0.254: COMM-CONN.5 39.28,49.93 39.28,49.51 34.38,44.61 28.94,44.61 28.32,45.23 IC1.18 | U3.26 35.8,79.49 37.04,78.25 38.76,78.25 v39.68,77.34 39.7,77.31
  Bottom 0.254: v39.68,77.34 41.23,75.79 42.55,75.79 43.61,74.73 43.61,72.76 43.69,72.68 43.69,54.41 COMM-CONN.5
N$1  (via drill 0.35 pad 0.55)
  Top 0.254: IC1.26 21.38,48.88 21.59,49.09 21.59,49.63 21.41,49.81 v21.41,51.11
  Bottom 0.61: C7.1 21.41,54.36 v21.41,51.11
N$2
  Bottom 1.016: J2.VBUS 11.51,7.51 POWER-JUMPER.3
N$3
  Bottom 1.016: J1.PWR 10.95,16.83 POWER-JUMPER.1
N$4
  Top 0.813: D1.C 39.19,6.72 R19.2
N$5
  Top 0.254: 34.74,54.97 C8.1 34.56,54.73 33.47,53.65 28.99,53.65 25.41,50.06 24.49,50.06 22.88,48.45 IC1.23
  Top 0.305: Y1.2 C8.1
N$6
  Top 0.254: IC1.24 22.38,48.59 24.27,50.47 25.24,50.47 C9.1
  Top 0.305: Y1.1 29.48,55.06 C9.1
N$7
  Top 0.254: IC1.19 29.27,45.73 R3.1
N$8
  Top 0.254: IC1.20 27.75,46.23 R4.1
N$9
  Top 0.254: IC1.13 22.98,42.74 22.98,42.1 25.72,39.36 R7.1
N$10  (via drill 0.35 pad 0.55)
  Top 0.254: IC1.12 22.38,41.72 v22.52,41.58 | v23.15,39.2 23.49,38.87 23.92,38.87 24.7,38.09 R15.2
  Bottom 0.254: v22.52,41.58 21.83,40.89 C11.1 23,39.2 v23.15,39.2
N$11
  Top 0.254: R10.2 14.2,50.31 17.78,46.73 IC1.1
N$12
  Top 0.254: R11.2 14.69,46.23 IC1.2
N$13
  Top 0.254: R12.2 14.39,45.23 14.89,45.73 IC1.3
N$14
  Top 0.254: R13.2 15.69,45.23 IC1.4
N$15
  Top 0.254: R14.2 17.73,44.73 IC1.5
N$16
  Top 1.27: POWER-JUMPER.2 15.29,10.15 5V-POWER-TESTPOINT.2
N$17
  Top 0.813: 3V3-POWER-TESTPOINT.2 30.93,12.45 U1.4 | U1.4 U1.2 | U1.4 25.94,20.71 26.09,20.55 27.66,20.55 27.98,20.88 27.98,21.02 C4.1 28.58,27.02 C3.1
N$18
  Top 0.813: 3V3-POWER-TESTPOINT1.1 72.11,12.47 C18.A L1.1 75.81,9.72 L2.1
N$19
  Top 0.66: R18.2 C16.2 | C16.2 61.61,9.24 R17.1 | C16.2 IC2.6
N$20
  Top 0.66: C15.1 IC2.1
N$21
  Top 0.66: C16.1 63.31,9.24 | 63.31,9.24 R17.2 | 63.31,9.24 62.67,8.6 62.67,8.52 62.39,8.23 59.41,8.23 IC2.5
  Top 0.813: C16.1 66.42,11.32 3V3-POWER-TESTPOINT1.2
N$22
  Top 0.406: U2.6 61.49,22.02 61.61,22.14 64.74,22.14 C14.1
N$23
  Top 0.813: L1.2 79.98,12.67 C19.A 82.27,11.81 85.41,11.81 R20.1
N$24
  Top 0.813: L2.2 80.03,9.7 C20.A 81.21,8.94 82.83,10.56 85.49,10.56 R21.1
N$25  (via drill 0.4)
  Top 0.406: U2.5 v61.93,21.38 61.95,21.38 | U2.8 v61.9,23.31 61.95,23.31
  Top 0.66: R26.1 48.63,24.54 50.24,26.15 50.29,26.15 51.67,27.53 57.69,27.53 v61.9,23.31
  Top 0.813: R26.1 C13.A
  Bottom 0.406: v61.9,23.31 62.13,23.31 62.54,22.91 62.54,21.99 v61.93,21.38
N$26  (via drill 0.4)
  Top 0.508: R22.2 51.07,25.17 51.97,26.07 53.41,26.07 53.65,25.83 53.65,25.72 55.17,24.2 U2.1
  Top 0.66: 55.17,24.2 56.29,25.32 v56.62,25.32 56.69,25.32
  Top 0.813: R22.2 C21.1
  Bottom 0.813: v56.62,25.32 60.94,25.32 3V3-POWER-TESTPOINT2.2
N$27
  Top 0.406: C21.2 53.82,22.83 53.98,22.68 U2.2
  Top 0.813: R22.1 C21.2 R23.2
N$28
  Top 0.813: L3.2 74.82,22.25 C23.A 77.27,24.13 79.81,24.13 81.69,22.25 R27.1
N$29
  Top 0.66: C17.A IC2.4 | R25.1 46.27,15.02 47.12,15.87 59.08,15.87 59.67,15.29 59.67,14.6 58.93,13.86 IC2.8
  Top 0.813: C17.A 49.1,9.85 R25.1
  Top 1.016: C17.A 48.92,9.85
N$30
  Top 0.813: L4.2 74.17,28.49 C24.A 77.32,25.34 79.8,25.34 R28.1
N$31
  Top 0.254: U3.7 28.84,78.46 27.89,78.46 26.57,77.13 26.57,76.32 25.86,75.61 | 25.86,75.61 C28.2 | R43.1 23.03,76.53 24.94,76.53 25.86,75.61
N$32
  Top 0.254: U3.9 28.8,77.41 28.34,77.41 27.38,76.45 27.38,74.65 26.14,73.4 C31.1
N$33
  Top 0.254: R32.2 22.1,66.87 22.71,66.26 29.52,66.26 31.1,67.85 U3.14
N$34
  Top 0.254: U3.4 28.87,80.01 R29.2
N$35
  Top 0.254: 33.58,82.16 33.58,81.3 33.48,81.2
N$36
  Top 0.254: U3.1 22.72,81.49 22.2,82.01 R31.2
N$37
  Top 0.254: U3.2 22.79,80.99 22.79,81 22.13,80.34 R30.2
N$38  (via drill 0.35)
  Top 0.254: v19.48,83.28 19.47,83.27 R31.1 15.54,78.08 J3.5
  Bottom 0.254: v19.48,83.28 20.51,84.31 D2.3
N$39  (via drill 0.35)
  Top 0.254: v19.51,79.12 19.5,79.13 R30.1 15.85,76.69 J3.9
  Bottom 0.254: v19.51,79.12 17.71,80.92 17.71,85.36 19.31,86.96 21.74,86.96 22.01,86.7 D2.6
N$40
  Top 0.254: R33.2 20.46,65.17 22.05,65.17 22.71,65.83 29.49,65.83 29.52,65.86 29.69,65.86 31.65,67.82 31.65,76.22 U3.15
N$41  (via drill 0.35)
  Top 0.254: J3.3 16.92,66.87 R32.1 18.74,67.88 v18.59,68.02 18.54,68.07
  Bottom 0.254: v18.59,68.02 17.53,68.02 16.37,66.86 D3.6
N$42  (via drill 0.35)
  Top 0.254: J3.2 15.82,65.2 R33.1 18.67,65.13 18.67,64.03 v18.57,63.93
  Bottom 0.254: v18.57,63.93 18.57,61.62 17.55,60.6 15.22,60.6 14.87,60.94 D3.3
N$43
  Top 0.254: Y2.1 29.52,88.91 R34.2 29.2,88.67 C32.2
N$44
  Top 0.254: Y2.3 34.45,92.93 34.45,91.19 33.43,90.17 R35.1 33.59,88.74 C33.1
N$45
  Top 0.254: U3.30 37.01,81.49 R36.1
N$46  (via drill 0.35)
  Top 0.254: U3.29 36.9,80.99 R37.2
  Top 0.305: v37.82,81.07 37.82,80.07 R37.2
  Bottom 0.305: v37.82,81.07 37.18,81.71 36.04,81.71 35.64,82.11 35.64,82.68 36.04,83.08 39.4,83.08 41.53,80.94 42.56,80.94 43.29,81.67 43.29,85.25 44.02,85.98 S2.3
N$47
  Top 0.254: 32.08,76.3 32.08,77.72
N$48
  Top 0.254: U3.37 31.1,85.71 32.27,86.88 R35.2
N$49
  Top 0.254: U3.35 32.1,83.96 34.42,86.28 R38.1
N$50
  Top 0.254: R42.1 23.92,79.23 26.36,79.23 26.63,79.49 U3.5
N$51
  Top 0.254: 33.61,76.25 33.61,77.82
N$52
  Top 0.254: R41.1 27.22,78.99 U3.6
N$53
  Top 0.254: U3.10 27.84,75.95 27.84,74.49 27.33,73.99 R40.1
N$54
  Top 0.254: U3.34 32.6,83.83 33.1,84.32 R39.1
N$60
  Top 0.254: 30.13,76.17 30.13,77.82
N$61
  Top 0.254: 28.93,77.87 29.11,78.05 29.82,78.05
N$62
  Top 0.152: 29.57,80.49 30.02,80.49
N$63
  Top 0.152: 29.72,80.51 29.72,81.28
N$64
  Top 0.152: 20.88,47.59 20.88,46.78
PD_ALM  (via drill 0.35)
  Top 0.254: U3.23 35.49,77.99 v37.06,76.42 37.09,76.4
  Bottom 0.254: J4.4 40.39,78 39.4,78 37.83,76.42 v37.06,76.42
RA
  Top 0.254: SIGNAL-CONN.1 R10.1
RL  (via drill 0.35)
  Top 0.254: v8.55,42.82 11.32,42.82 R13.1
  Bottom 0.254: SIGNAL-CONN.6 7.72,42.82 v8.55,42.82
RLDIN  (via drill 0.35 pad 0.55)
  Top 0.254: IC1.11 21.88,41.97 20.9,40.98 20.9,39.55 21.73,38.72 | 21.73,38.72 22.36,38.09 R15.1 23.51,38.09 | v35.22,38.09 26.4,38.09 25.62,38.87 24.5,38.87 23.51,39.86 22.86,39.86 21.73,38.72
  Bottom 0.254: v35.22,38.09 38.24,35.07 38.24,32.06 39.98,30.31 TEST-CONN.5
RLDINIV  (via drill 0.35 pad 0.55)
  Top 0.254: IC1.10 21.38,42.04 R9.1 19.78,37.39 | R8.1 16.64,37.45 17.45,36.64 19.03,36.64 19.78,37.39 | 19.78,37.39 C12.2 22.48,37.42 22.59,37.31 30.76,37.31 30.93,37.14 v35.22,37.14 | v36.49,32.85 TEST-CONN.4
  Bottom 0.254: v35.22,37.14 35.22,34.12 v36.49,32.85
RLDOUT  (via drill 0.35 pad 0.55)
  Top 0.254: C12.1 18.11,40.41 | 18.11,40.41 R9.2 | IC1.9 20.79,42.74 20.79,42.42 20.27,41.9 v19.5,41.9 18.11,40.51 18.11,40.41 | TEST-CONN.3 42.05,36.21 43.26,37.42 43.26,38.44 42.55,39.15 31.3,39.15 v29.5,41.1
  Bottom 0.254: v19.5,41.9 21.91,41.9 22.25,42.24 28.37,42.24 v29.5,41.1
RSTBCON  (via drill 0.35, 0.35 pad 0.55)
  Top 0.254: IC1.25 21.88,48.81 22,48.92 22,49.52 22.31,49.84 v22.36,49.84 | v23.42,57.37 25.83,59.79 25.83,62.02 27.59,63.77 41.2,63.77 COMM-CONN.1
  Top 0.305: v42.24,67 56.26,81.01 S1.3
  Bottom 0.254: R2.1 22.86,51.88 | 22.86,51.88 22.36,51.38 v22.36,49.84 | 22.86,51.88 22.86,56.8 v23.42,57.37
  Bottom 0.305: COMM-CONN.1 42.05,66.8 v42.24,67
RX_ANA_SUP  (via drill 0.35)
  Top 0.152: U3.33 33.1,81.84 32.81,81.54 30.24,81.54 30.1,81.68 U3.39
  Top 0.254: U3.39 30.1,83.3 28.35,85.06 v27.84,85.06 26.46,85.06 C30.1
  Top 1.016: R28.2 83.4,28.91 81.54,30.78 54.89,30.78 J5.1
  Bottom 0.254: D2.5 21.26,85.24 | 21.26,85.24 21.26,84.88 | 21.26,84.88 D2.2 | v27.84,85.06 21.44,85.06 | 21.44,85.06 21.26,84.88 | 21.44,85.06 21.26,85.24
  Bottom 0.508: v27.84,85.06 27.84,86.63 24.08,90.39 24.08,94.41 25.83,96.16 | 44.83,67.51 44.71,67.38
  Bottom 0.61: 25.83,96.16 36.53,96.16 41.12,91.56 44.6,91.56 45.42,90.74 45.42,89.59 44.71,88.88 44.71,67.38
  Bottom 1.016: J5.1 44.71,39.9 44.71,67.38
RX_DIG_SUP  (via drill 0.35)
  Top 0.254: U3.31 34.11,82.98 34.68,83.54 36.54,83.54 | C29.1 37.32,84.32 36.54,83.54 | R37.1 39.59,80.7 v39.58,81.1 | v36.32,82.39 36.32,83.32 36.54,83.54
  Top 1.016: J5.2 81.18,32.79 84.61,29.36 84.61,26.48 83.43,25.29 R27.2
  Bottom 0.254: v39.58,81.1 38.28,82.39 v36.32,82.39
  Bottom 1.016: v39.58,81.1 39.58,80.41 36.02,76.85 36.02,75.99 37.49,74.52 37.49,53.67 40.45,50.72 34.18,44.45 34.18,33.69 39.22,28.65 55.02,28.65 55.96,29.58 55.96,30.91 54.36,32.51 J5.2
RX_SUP
  Top 0.813: 3V3-POWER-TESTPOINT2.1 66.22,28.57 C22.A 70.02,28.52 L4.1 L3.1
SCLK  (via drill 0.35)
  Top 0.254: IC1.17 28.25,44.73 28.77,44.21 36.1,44.21 COMM-CONN.6 | U3.24 35.65,78.49 36.71,77.44 37.95,77.44 38.28,77.11 v38.28,75.23
  Bottom 0.254: COMM-CONN.6 38.28,54 v38.28,75.23
SS
  Top 0.254: IC1.16 28.17,44.23 28.6,43.8 38.23,43.8 COMM-CONN.7
STE
  Top 0.254: U3.27 35.88,79.99 37.21,78.66 39.92,78.66 40.83,77.75 40.83,76.6 41.54,75.89 42.55,75.89 43.26,76.6 43.26,78.31 | 43.26,78.31 43.28,78.33 | 43.26,78.31 43.26,86.05 J4.1
TX_CTRL_SUP  (via drill 0.35)
  Top 0.254: U3.11 29.6,74.04 C25.1 28.59,74.02 v28.58,74.01
  Top 1.016: R21.2 88.84,11.55 89.84,12.56 89.84,27.43 79.41,37.87 J5.4 44.81,47.41 44.81,64.08 43.16,65.73 36.48,65.73 v33.43,68.78 33.38,68.83
  Bottom 0.508: v28.58,74.01 31.19,71.39 32.36,71.39 33.43,70.33 v33.43,68.78
V1
  Top 0.254: SIGNAL-CONN.4 5.25,42.69 7.98,39.96 11.25,39.96 R14.1
VCM_SHIELD  (via drill 0.35)
  Top 0.254: R29.1 23.92,79.93 23.07,79.93 v22.58,79.45 | v22.58,79.45 22.56,79.42 | v22.4,83.33 23.24,82.49 C27.1 | v22.58,79.45 22.28,79.14 20.35,79.14 20.17,78.96 20.17,78.84 19.78,78.46 19.24,78.46 19.04,78.66 18.72,78.66 16.33,76.27 12.37,76.27 | v22.4,83.33 20.5,83.33 19.89,83.94 19.21,83.94 18.83,83.55 18.83,83.08 18.64,82.9 18.64,81.76 15.37,78.48 12.57,78.48 | v22.4,83.33 22.68,83.61 22.68,86.86 22.1,87.45 19.15,87.45 17.27,85.57 17.27,82.16
  Bottom 0.254: v22.58,79.45 22.4,79.62 v22.4,83.33
WCT  (via drill 0.35 pad 0.55)
  Top 0.254: IC1.7 18,43.73 v17.92,43.65 | v31.73,39.84 32.36,40.47 TEST-CONN.1
  Bottom 0.254: v17.92,43.65 16.96,42.69 16.96,42.22 21.25,37.93 30.62,37.93 31.73,39.04 v31.73,39.84
XIN_MSP  (via drill 0.35)
  Top 0.254: U3.38 30.6,84.99 29.24,86.36 R34.1 30.52,86.93 v30.53,86.94
  Bottom 0.254: v30.53,86.94 31.42,86.05 31.42,84.99 31.81,84.61 32.35,84.61 32.43,84.68 40.11,84.68 42.05,82.74 J4.3

### Text on the board
tPlace: RST_ADS | RST_AFE | STE | CLKOUT | XIN_MSP | PD_ALM | ADC_RDY | LED_ALM | DIAG_END | AFE_PDN | RST | 4.096mHZ | CLK | DRD | MISO | MOSI | SCLK | CS | ALRM | WCT | GND_AFE | CMO | TX_DRV_SUP | RLDO | LED_DRV_SUP | PLDI | RX_DIG_SUP | RLDI | RX_ANA_SUP | GND | 3V3 | 5V | 5V TESTP | 3V3 TESTP | POWER-SEL | 2017-05-28
tNames: AFE MODULE | 8MHz | AFE-ADS-Joint Test PCB Rev. 01 | IC2 | By Jingjie Li, XJTU-BME | AFE4400 | AFE-CONN | ADS MODULE | IC1 | COMM-CONN | ADS-1293 | ECG LEADS CONN | AFE_PWR | TESTP-CONN | LM1117 | POWER-CONN | U1 | LDO MODULE | LDO MODULE